# EAGLE schematic hw_DAA (EAGLE 7.6.0), part 3 of 4
## Sheet 22 of 34: DRR4 Memories 3-4
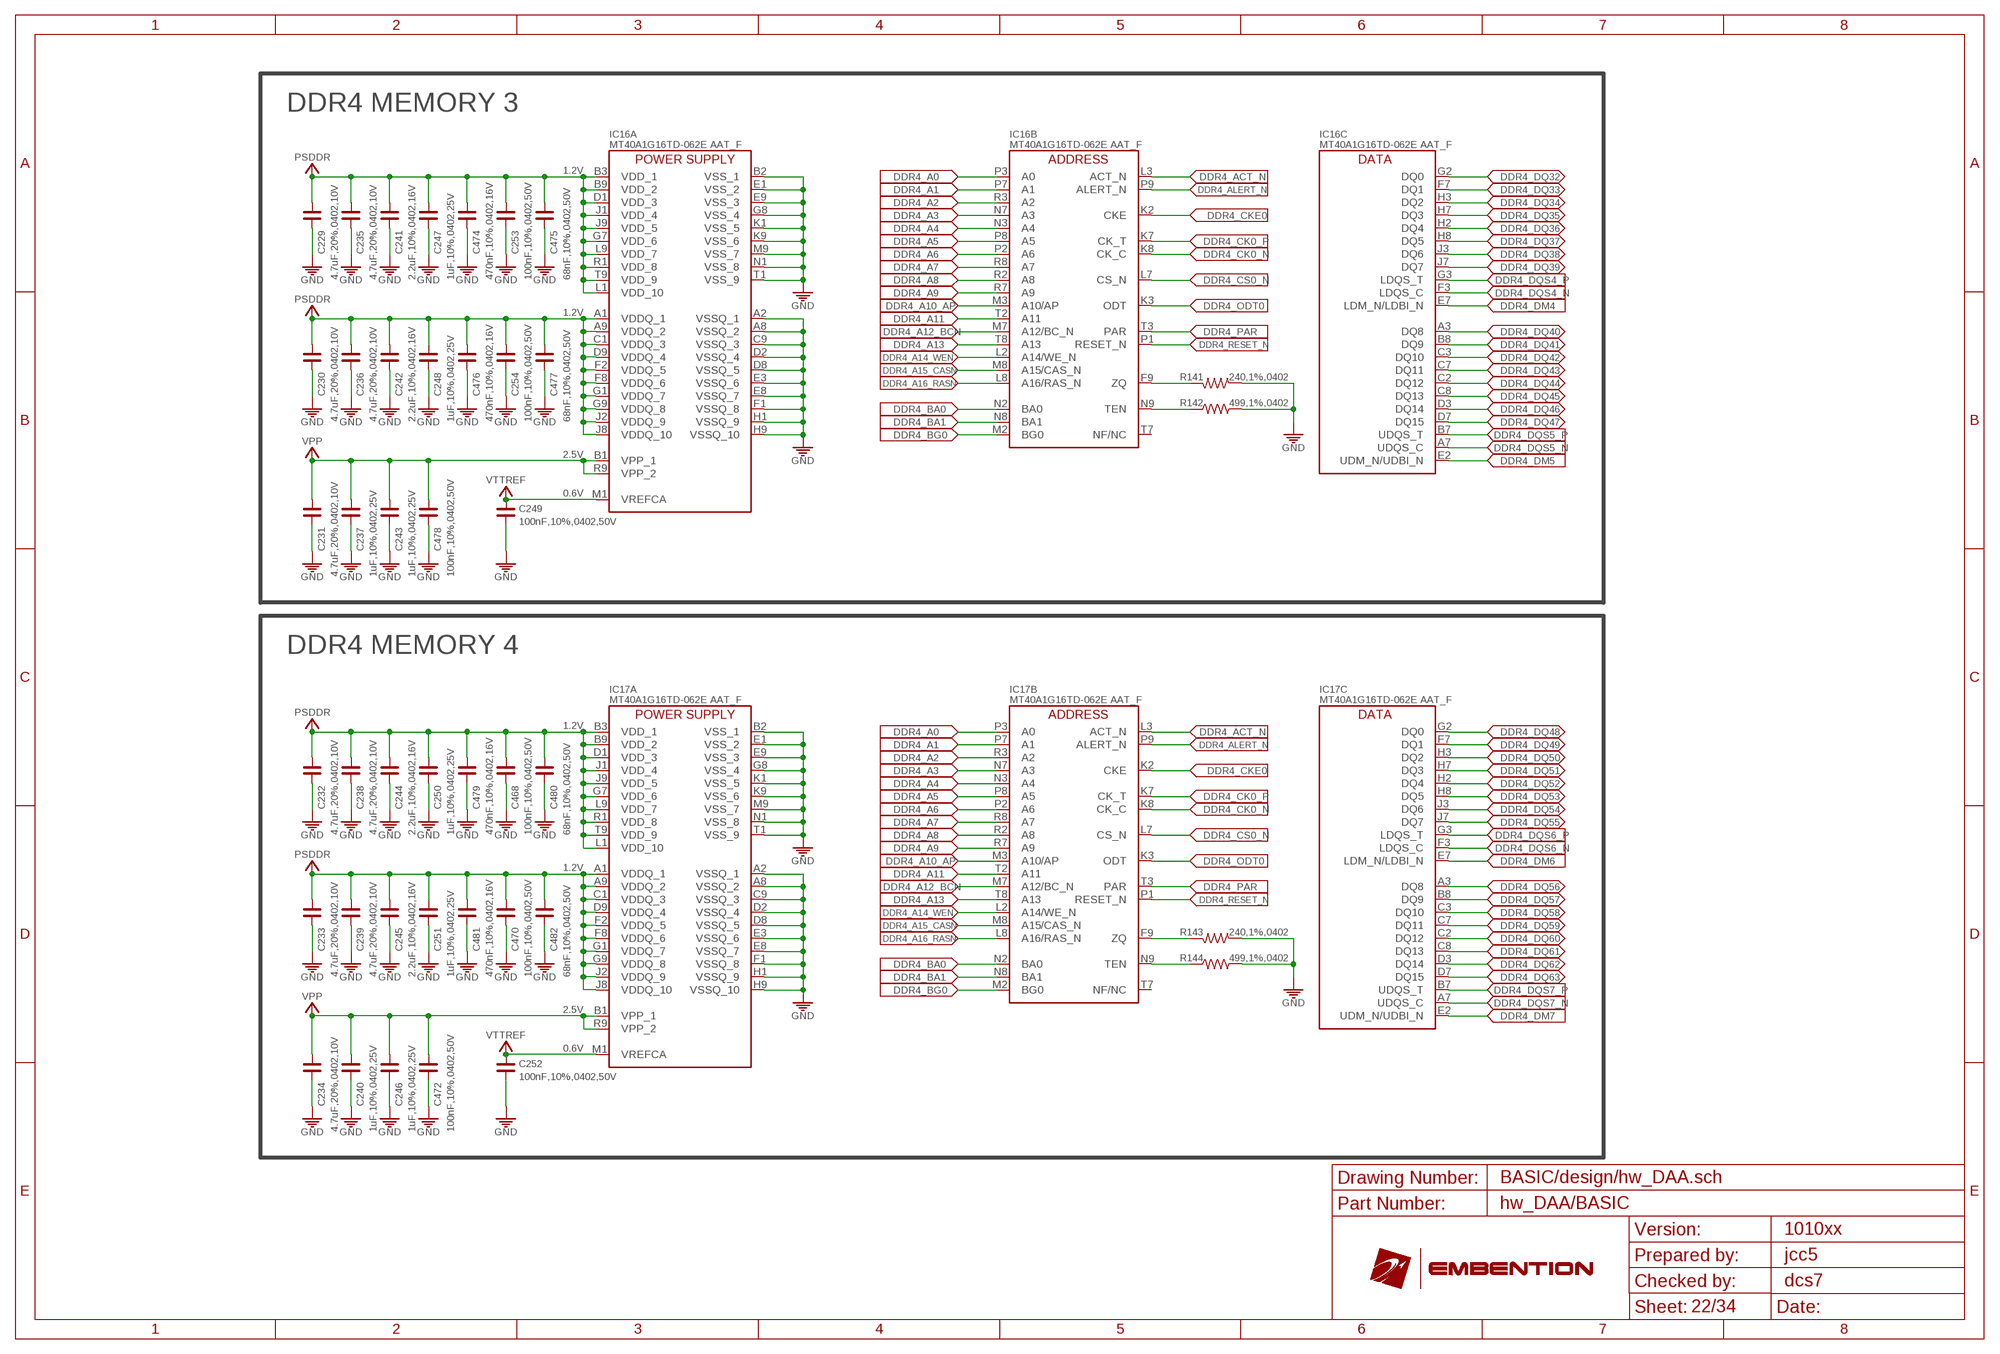
[diagram p21: schematic, sheet 22]

### Parts
C229  4.7uF,20%,0402,10V  C_0402  [C0402]
C230  4.7uF,20%,0402,10V  C_0402  [C0402]
C231  4.7uF,20%,0402,10V  C_0402  [C0402]
C232  4.7uF,20%,0402,10V  C_0402  [C0402]
C233  4.7uF,20%,0402,10V  C_0402  [C0402]
C234  4.7uF,20%,0402,10V  C_0402  [C0402]
C235  4.7uF,20%,0402,10V  C_0402  [C0402]
C236  4.7uF,20%,0402,10V  C_0402  [C0402]
C237  1uF,10%,0402,25V  C_0402  [C0402]
C238  4.7uF,20%,0402,10V  C_0402  [C0402]
C239  4.7uF,20%,0402,10V  C_0402  [C0402]
C240  1uF,10%,0402,25V  C_0402  [C0402]
C241  2.2uF,10%,0402,16V  C_0402  [C0402]
C242  2.2uF,10%,0402,16V  C_0402  [C0402]
C243  1uF,10%,0402,25V  C_0402  [C0402]
C244  2.2uF,10%,0402,16V  C_0402  [C0402]
C245  2.2uF,10%,0402,16V  C_0402  [C0402]
C246  1uF,10%,0402,25V  C_0402  [C0402]
C247  1uF,10%,0402,25V  C_0402  [C0402]
C248  1uF,10%,0402,25V  C_0402  [C0402]
C249  100nF,10%,0402,50V  C_0402  [C0402]
C250  1uF,10%,0402,25V  C_0402  [C0402]
C251  1uF,10%,0402,25V  C_0402  [C0402]
C252  100nF,10%,0402,50V  C_0402  [C0402]
C253  100nF,10%,0402,50V  C_0402  [C0402]
C254  100nF,10%,0402,50V  C_0402  [C0402]
C468  100nF,10%,0402,50V  C_0402  [C0402]
C470  100nF,10%,0402,50V  C_0402  [C0402]
C472  100nF,10%,0402,50V  C_0402  [C0402]
C474  470nF,10%,0402,16V  C_0402  [C0402]
C475  68nF,10%,0402,50V  C_0402  [C0402]
C476  470nF,10%,0402,16V  C_0402  [C0402]
C477  68nF,10%,0402,50V  C_0402  [C0402]
C478  100nF,10%,0402,50V  C_0402  [C0402]
C479  470nF,10%,0402,16V  C_0402  [C0402]
C480  68nF,10%,0402,50V  C_0402  [C0402]
C481  470nF,10%,0402,16V  C_0402  [C0402]
C482  68nF,10%,0402,50V  C_0402  [C0402]
IC16  MT40A1G16TD-062E AAT_F  MT40A1G16TD-062ENSMD  [FBGA96_NSMD_MICRON]
IC17  MT40A1G16TD-062E AAT_F  MT40A1G16TD-062ENSMD  [FBGA96_NSMD_MICRON]
R141  240,1%,0402  R_0402  [R0402]
R142  499,1%,0402  R_0402  [R0402]
R143  240,1%,0402  R_0402  [R0402]
R144  499,1%,0402  R_0402  [R0402]

### Nets
DDR4_A0 [DDR4_50]: IC16.P3(B:A0) IC17.P3(B:A0) ; also sheet 20,21,23
DDR4_A1 [DDR4_50]: IC16.P7(B:A1) IC17.P7(B:A1) ; also sheet 20,21,23
DDR4_A2 [DDR4_50]: IC16.R3(B:A2) IC17.R3(B:A2) ; also sheet 20,21,23
DDR4_A3 [DDR4_50]: IC16.N7(B:A3) IC17.N7(B:A3) ; also sheet 20,21,23
DDR4_A4 [DDR4_50]: IC16.N3(B:A4) IC17.N3(B:A4) ; also sheet 20,21,23
DDR4_A5 [DDR4_50]: IC16.P8(B:A5) IC17.P8(B:A5) ; also sheet 20,21,23
DDR4_A6 [DDR4_50]: IC16.P2(B:A6) IC17.P2(B:A6) ; also sheet 20,21,23
DDR4_A7 [DDR4_50]: IC16.R8(B:A7) IC17.R8(B:A7) ; also sheet 20,21,23
DDR4_A8 [DDR4_50]: IC16.R2(B:A8) IC17.R2(B:A8) ; also sheet 20,21,23
DDR4_A9 [DDR4_50]: IC16.R7(B:A9) IC17.R7(B:A9) ; also sheet 20,21,23
DDR4_A10_AP [DDR4_50]: IC16.M3(B:A10/AP) IC17.M3(B:A10/AP) ; also sheet 20,21,23
DDR4_A11 [DDR4_50]: IC16.T2(B:A11) IC17.T2(B:A11) ; also sheet 20,21,23
DDR4_A12_BCN [DDR4_50]: IC16.M7(B:A12/BC_N) IC17.M7(B:A12/BC_N) ; also sheet 20,21,23
DDR4_A13 [DDR4_50]: IC16.T8(B:A13) IC17.T8(B:A13) ; also sheet 20,21,23
DDR4_A14_WEN [DDR4_50]: IC16.L2(B:A14/WE_N) IC17.L2(B:A14/WE_N) ; also sheet 20,21,23
DDR4_A15_CASN [DDR4_50]: IC16.M8(B:A15/CAS_N) IC17.M8(B:A15/CAS_N) ; also sheet 20,21,23
DDR4_A16_RASN [DDR4_50]: IC16.L8(B:A16/RAS_N) IC17.L8(B:A16/RAS_N) ; also sheet 20,21,23
DDR4_ACT_N [DDR4_50]: IC16.L3(B:ACT_N) IC17.L3(B:ACT_N) ; also sheet 20,21,23
DDR4_ALERT_N [DDR4_50]: IC16.P9(B:ALERT_N) IC17.P9(B:ALERT_N) ; also sheet 20,21,23
DDR4_BA0 [DDR4_50]: IC16.N2(B:BA0) IC17.N2(B:BA0) ; also sheet 20,21,23
DDR4_BA1 [DDR4_50]: IC16.N8(B:BA1) IC17.N8(B:BA1) ; also sheet 20,21,23
DDR4_BG0 [DDR4_50]: IC16.M2(B:BG0) IC17.M2(B:BG0) ; also sheet 20,21,23
DDR4_CK0_N [DDR4_90]: IC16.K8(B:CK_C) IC17.K8(B:CK_C) ; also sheet 20,21,23
DDR4_CK0_P [DDR4_90]: IC16.K7(B:CK_T) IC17.K7(B:CK_T) ; also sheet 20,21,23
DDR4_CKE0 [DDR4_50]: IC16.K2(B:CKE) IC17.K2(B:CKE) ; also sheet 20,21,23
DDR4_CS0_N [DDR4_50]: IC16.L7(B:CS_N) IC17.L7(B:CS_N) ; also sheet 20,21,23
DDR4_DM4 [DDR4_50]: IC16.E7(C:LDM_N/LDBI_N) ; also sheet 20
DDR4_DM5 [DDR4_50]: IC16.E2(C:UDM_N/UDBI_N) ; also sheet 20
DDR4_DM6 [DDR4_50]: IC17.E7(C:LDM_N/LDBI_N) ; also sheet 20
DDR4_DM7 [DDR4_50]: IC17.E2(C:UDM_N/UDBI_N) ; also sheet 20
DDR4_DQ32 [DDR4_50]: IC16.G2(C:DQ0) ; also sheet 20
DDR4_DQ33 [DDR4_50]: IC16.F7(C:DQ1) ; also sheet 20
DDR4_DQ34 [DDR4_50]: IC16.H3(C:DQ2) ; also sheet 20
DDR4_DQ35 [DDR4_50]: IC16.H7(C:DQ3) ; also sheet 20
DDR4_DQ36 [DDR4_50]: IC16.H2(C:DQ4) ; also sheet 20
DDR4_DQ37 [DDR4_50]: IC16.H8(C:DQ5) ; also sheet 20
DDR4_DQ38 [DDR4_50]: IC16.J3(C:DQ6) ; also sheet 20
DDR4_DQ39 [DDR4_50]: IC16.J7(C:DQ7) ; also sheet 20
DDR4_DQ40 [DDR4_50]: IC16.A3(C:DQ8) ; also sheet 20
DDR4_DQ41 [DDR4_50]: IC16.B8(C:DQ9) ; also sheet 20
DDR4_DQ42 [DDR4_50]: IC16.C3(C:DQ10) ; also sheet 20
DDR4_DQ43 [DDR4_50]: IC16.C7(C:DQ11) ; also sheet 20
DDR4_DQ44 [DDR4_50]: IC16.C2(C:DQ12) ; also sheet 20
DDR4_DQ45 [DDR4_50]: IC16.C8(C:DQ13) ; also sheet 20
DDR4_DQ46 [DDR4_50]: IC16.D3(C:DQ14) ; also sheet 20
DDR4_DQ47 [DDR4_50]: IC16.D7(C:DQ15) ; also sheet 20
DDR4_DQ48 [DDR4_50]: IC17.G2(C:DQ0) ; also sheet 20
DDR4_DQ49 [DDR4_50]: IC17.F7(C:DQ1) ; also sheet 20
DDR4_DQ50 [DDR4_50]: IC17.H3(C:DQ2) ; also sheet 20
DDR4_DQ51 [DDR4_50]: IC17.H7(C:DQ3) ; also sheet 20
DDR4_DQ52 [DDR4_50]: IC17.H2(C:DQ4) ; also sheet 20
DDR4_DQ53 [DDR4_50]: IC17.H8(C:DQ5) ; also sheet 20
DDR4_DQ54 [DDR4_50]: IC17.J3(C:DQ6) ; also sheet 20
DDR4_DQ55 [DDR4_50]: IC17.J7(C:DQ7) ; also sheet 20
DDR4_DQ56 [DDR4_50]: IC17.A3(C:DQ8) ; also sheet 20
DDR4_DQ57 [DDR4_50]: IC17.B8(C:DQ9) ; also sheet 20
DDR4_DQ58 [DDR4_50]: IC17.C3(C:DQ10) ; also sheet 20
DDR4_DQ59 [DDR4_50]: IC17.C7(C:DQ11) ; also sheet 20
DDR4_DQ60 [DDR4_50]: IC17.C2(C:DQ12) ; also sheet 20
DDR4_DQ61 [DDR4_50]: IC17.C8(C:DQ13) ; also sheet 20
DDR4_DQ62 [DDR4_50]: IC17.D3(C:DQ14) ; also sheet 20
DDR4_DQ63 [DDR4_50]: IC17.D7(C:DQ15) ; also sheet 20
DDR4_DQS4_N [DDR4_90]: IC16.F3(C:LDQS_C) ; also sheet 20
DDR4_DQS4_P [DDR4_90]: IC16.G3(C:LDQS_T) ; also sheet 20
DDR4_DQS5_N [DDR4_90]: IC16.A7(C:UDQS_C) ; also sheet 20
DDR4_DQS5_P [DDR4_90]: IC16.B7(C:UDQS_T) ; also sheet 20
DDR4_DQS6_N [DDR4_90]: IC17.F3(C:LDQS_C) ; also sheet 20
DDR4_DQS6_P [DDR4_90]: IC17.G3(C:LDQS_T) ; also sheet 20
DDR4_DQS7_N [DDR4_90]: IC17.A7(C:UDQS_C) ; also sheet 20
DDR4_DQS7_P [DDR4_90]: IC17.B7(C:UDQS_T) ; also sheet 20
DDR4_ODT0 [DDR4_50]: IC16.K3(B:ODT) IC17.K3(B:ODT) ; also sheet 20,21,23
DDR4_PAR [DDR4_50]: IC16.T3(B:PAR) IC17.T3(B:PAR) ; also sheet 20,21,23
DDR4_RESET_N [DDR4_50]: IC16.P1(B:RESET_N) IC17.P1(B:RESET_N) ; also sheet 20,21,23
DDR4_TEN_2: IC16.N9(B:TEN) R142.1
DDR4_TEN_3: IC17.N9(B:TEN) R144.1
DDR4_ZQ_2: IC16.F9(B:ZQ) R141.2
DDR4_ZQ_3: IC17.F9(B:ZQ) R143.2
GND: C229.2 C230.2 C231.2 C232.2 C233.2 C234.2 C235.2 C236.2 C237.2 C238.2 C239.2 C240.2 C241.2 C242.2 C243.2 C244.2 C245.2 C246.2 C247.2 C248.2 C249.2 C250.2 C251.2 C252.2 C253.2 C254.2 C468.2 C470.2 C472.2 C474.2 C475.2 C476.2 C477.2 C478.2 C479.2 C480.2 C481.2 C482.2 IC16.A2(A:VSSQ_1) IC16.A8(A:VSSQ_2) IC16.B2(A:VSS_1) IC16.C9(A:VSSQ_3) IC16.D2(A:VSSQ_4) IC16.D8(A:VSSQ_5) IC16.E1(A:VSS_2) IC16.E3(A:VSSQ_6) IC16.E8(A:VSSQ_7) IC16.E9(A:VSS_3) IC16.F1(A:VSSQ_8) IC16.G8(A:VSS_4) IC16.H1(A:VSSQ_9) IC16.H9(A:VSSQ_10) IC16.K1(A:VSS_5) IC16.K9(A:VSS_6) IC16.M9(A:VSS_7) IC16.N1(A:VSS_8) IC16.T1(A:VSS_9) IC17.A2(A:VSSQ_1) IC17.A8(A:VSSQ_2) IC17.B2(A:VSS_1) IC17.C9(A:VSSQ_3) IC17.D2(A:VSSQ_4) IC17.D8(A:VSSQ_5) IC17.E1(A:VSS_2) IC17.E3(A:VSSQ_6) IC17.E8(A:VSSQ_7) IC17.E9(A:VSS_3) IC17.F1(A:VSSQ_8) IC17.G8(A:VSS_4) IC17.H1(A:VSSQ_9) IC17.H9(A:VSSQ_10) IC17.K1(A:VSS_5) IC17.K9(A:VSS_6) IC17.M9(A:VSS_7) IC17.N1(A:VSS_8) IC17.T1(A:VSS_9) R141.1 R142.2 R143.1 R144.2 ; also sheet 2,3,4,5,6,7,8,9,10,11,12,13,14,15,17,18,20,21,23,24,25,26,27,28,29,30,31,32,33
PSDDR: C229.1 C230.1 C232.1 C233.1 C235.1 C236.1 C238.1 C239.1 C241.1 C242.1 C244.1 C245.1 C247.1 C248.1 C250.1 C251.1 C253.1 C254.1 C468.1 C470.1 C474.1 C475.1 C476.1 C477.1 C479.1 C480.1 C481.1 C482.1 IC16.A1(A:VDDQ_1) IC16.A9(A:VDDQ_2) IC16.B3(A:VDD_1) IC16.B9(A:VDD_2) IC16.C1(A:VDDQ_3) IC16.D1(A:VDD_3) IC16.D9(A:VDDQ_4) IC16.F2(A:VDDQ_5) IC16.F8(A:VDDQ_6) IC16.G1(A:VDDQ_7) IC16.G7(A:VDD_6) IC16.G9(A:VDDQ_8) IC16.J1(A:VDD_4) IC16.J2(A:VDDQ_9) IC16.J8(A:VDDQ_10) IC16.J9(A:VDD_5) IC16.L1(A:VDD_10) IC16.L9(A:VDD_7) IC16.R1(A:VDD_8) IC16.T9(A:VDD_9) IC17.A1(A:VDDQ_1) IC17.A9(A:VDDQ_2) IC17.B3(A:VDD_1) IC17.B9(A:VDD_2) IC17.C1(A:VDDQ_3) IC17.D1(A:VDD_3) IC17.D9(A:VDDQ_4) IC17.F2(A:VDDQ_5) IC17.F8(A:VDDQ_6) IC17.G1(A:VDDQ_7) IC17.G7(A:VDD_6) IC17.G9(A:VDDQ_8) IC17.J1(A:VDD_4) IC17.J2(A:VDDQ_9) IC17.J8(A:VDDQ_10) IC17.J9(A:VDD_5) IC17.L1(A:VDD_10) IC17.L9(A:VDD_7) IC17.R1(A:VDD_8) IC17.T9(A:VDD_9) ; also sheet 8,12,21,23
VPP: C231.1 C234.1 C237.1 C240.1 C243.1 C246.1 C472.1 C478.1 IC16.B1(A:VPP_1) IC16.R9(A:VPP_2) IC17.B1(A:VPP_1) IC17.R9(A:VPP_2) ; also sheet 8,21,23
VTTREF: C249.1 C252.1 IC16.M1(A:VREFCA) IC17.M1(A:VREFCA) ; also sheet 8,21,23
Unconnected: IC16.T7(B:NF/NC) IC17.T7(B:NF/NC)

### Notes on the sheet
- DDR4 MEMORY 3
- 1.2V
- 1.2V
- 2.5V
- 0.6V
- DDR4 MEMORY 4
- 1.2V
- 1.2V
- 2.5V
- 0.6V
- BASIC/design/hw_DAA.sch
- hw_DAA/BASIC
- 1010xx
- jcc5
- dcs7

## Sheet 23 of 34: DDR4 Memory ECC Bank
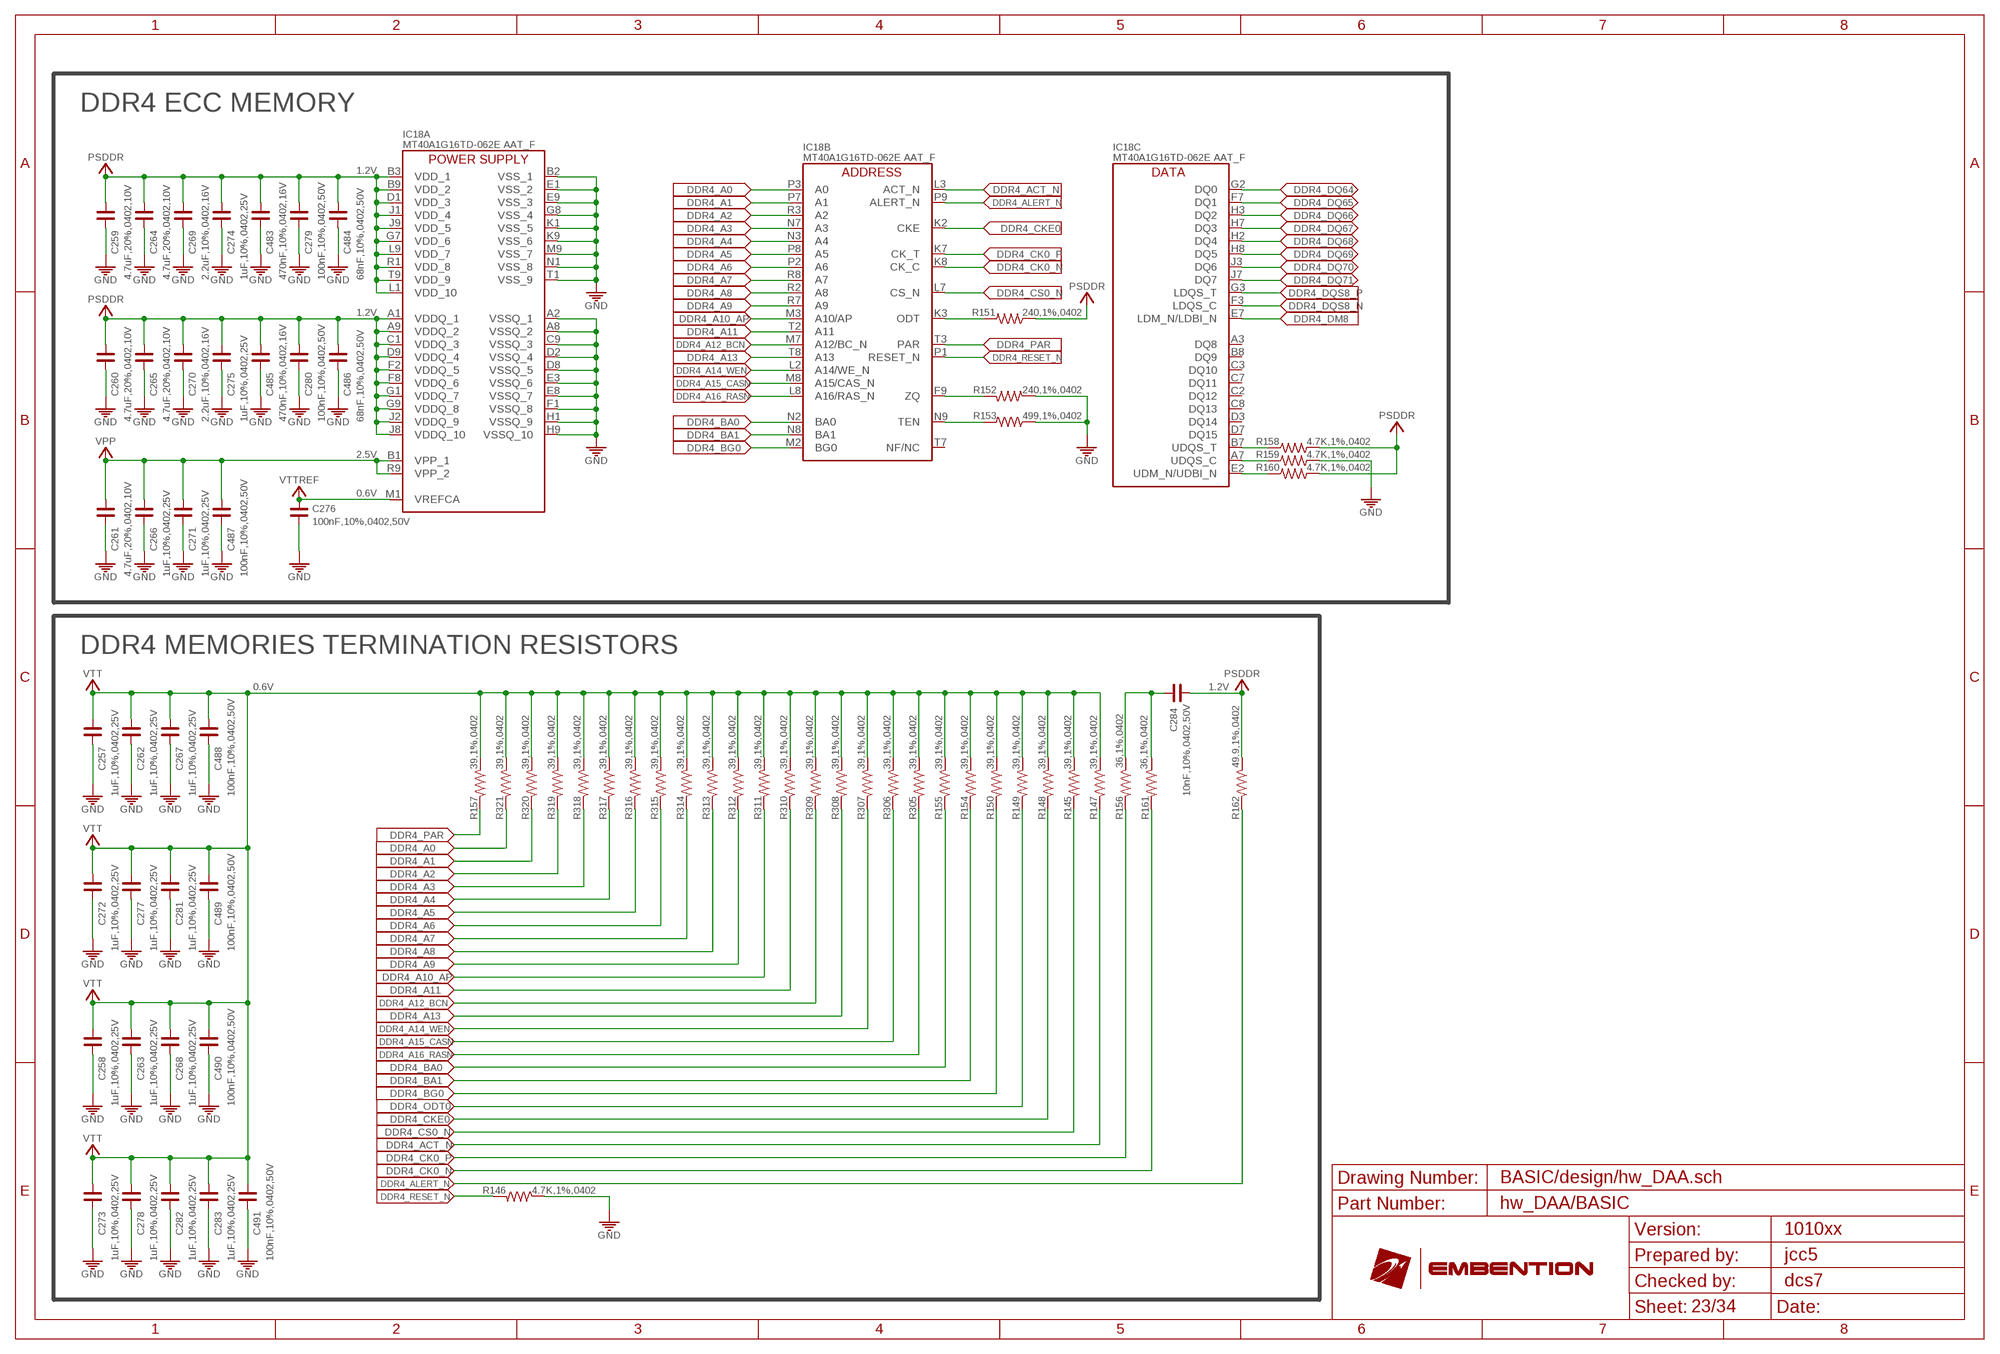
[diagram p22: schematic, sheet 23]

### Parts
C257  1uF,10%,0402,25V  C_0402  [C0402]
C258  1uF,10%,0402,25V  C_0402  [C0402]
C259  4.7uF,20%,0402,10V  C_0402  [C0402]
C260  4.7uF,20%,0402,10V  C_0402  [C0402]
C261  4.7uF,20%,0402,10V  C_0402  [C0402]
C262  1uF,10%,0402,25V  C_0402  [C0402]
C263  1uF,10%,0402,25V  C_0402  [C0402]
C264  4.7uF,20%,0402,10V  C_0402  [C0402]
C265  4.7uF,20%,0402,10V  C_0402  [C0402]
C266  1uF,10%,0402,25V  C_0402  [C0402]
C267  1uF,10%,0402,25V  C_0402  [C0402]
C268  1uF,10%,0402,25V  C_0402  [C0402]
C269  2.2uF,10%,0402,16V  C_0402  [C0402]
C270  2.2uF,10%,0402,16V  C_0402  [C0402]
C271  1uF,10%,0402,25V  C_0402  [C0402]
C272  1uF,10%,0402,25V  C_0402  [C0402]
C273  1uF,10%,0402,25V  C_0402  [C0402]
C274  1uF,10%,0402,25V  C_0402  [C0402]
C275  1uF,10%,0402,25V  C_0402  [C0402]
C276  100nF,10%,0402,50V  C_0402  [C0402]
C277  1uF,10%,0402,25V  C_0402  [C0402]
C278  1uF,10%,0402,25V  C_0402  [C0402]
C279  100nF,10%,0402,50V  C_0402  [C0402]
C280  100nF,10%,0402,50V  C_0402  [C0402]
C281  1uF,10%,0402,25V  C_0402  [C0402]
C282  1uF,10%,0402,25V  C_0402  [C0402]
C283  1uF,10%,0402,25V  C_0402  [C0402]
C284  10nF,10%,0402,50V  C_0402  [C0402]
C483  470nF,10%,0402,16V  C_0402  [C0402]
C484  68nF,10%,0402,50V  C_0402  [C0402]
C485  470nF,10%,0402,16V  C_0402  [C0402]
C486  68nF,10%,0402,50V  C_0402  [C0402]
C487  100nF,10%,0402,50V  C_0402  [C0402]
C488  100nF,10%,0402,50V  C_0402  [C0402]
C489  100nF,10%,0402,50V  C_0402  [C0402]
C490  100nF,10%,0402,50V  C_0402  [C0402]
C491  100nF,10%,0402,50V  C_0402  [C0402]
IC18  MT40A1G16TD-062E AAT_F  MT40A1G16TD-062ENSMD  [FBGA96_NSMD_MICRON]
R145  39,1%,0402  R_0402  [R0402]
R146  4.7K,1%,0402  R_0402  [R0402]
R147  39,1%,0402  R_0402  [R0402]
R148  39,1%,0402  R_0402  [R0402]
R149  39,1%,0402  R_0402  [R0402]
R150  39,1%,0402  R_0402  [R0402]
R151  240,1%,0402  R_0402  [R0402]
R152  240,1%,0402  R_0402  [R0402]
R153  499,1%,0402  R_0402  [R0402]
R154  39,1%,0402  R_0402  [R0402]
R155  39,1%,0402  R_0402  [R0402]
R156  36,1%,0402  R_0402  [R0402]
R157  39,1%,0402  R_0402  [R0402]
R158  4.7K,1%,0402  R_0402  [R0402]
R159  4.7K,1%,0402  R_0402  [R0402]
R160  4.7K,1%,0402  R_0402  [R0402]
R161  36,1%,0402  R_0402  [R0402]
R162  49.9,1%,0402  R_0402  [R0402]
R305  39,1%,0402  R_0402  [R0402]
R306  39,1%,0402  R_0402  [R0402]
R307  39,1%,0402  R_0402  [R0402]
R308  39,1%,0402  R_0402  [R0402]
R309  39,1%,0402  R_0402  [R0402]
R310  39,1%,0402  R_0402  [R0402]
R311  39,1%,0402  R_0402  [R0402]
R312  39,1%,0402  R_0402  [R0402]
R313  39,1%,0402  R_0402  [R0402]
R314  39,1%,0402  R_0402  [R0402]
R315  39,1%,0402  R_0402  [R0402]
R316  39,1%,0402  R_0402  [R0402]
R317  39,1%,0402  R_0402  [R0402]
R318  39,1%,0402  R_0402  [R0402]
R319  39,1%,0402  R_0402  [R0402]
R320  39,1%,0402  R_0402  [R0402]
R321  39,1%,0402  R_0402  [R0402]

### Nets
DDR4_A0 [DDR4_50]: IC18.P3(B:A0) R321.2 ; also sheet 20,21,22
DDR4_A1 [DDR4_50]: IC18.P7(B:A1) R320.2 ; also sheet 20,21,22
DDR4_A2 [DDR4_50]: IC18.R3(B:A2) R319.2 ; also sheet 20,21,22
DDR4_A3 [DDR4_50]: IC18.N7(B:A3) R318.2 ; also sheet 20,21,22
DDR4_A4 [DDR4_50]: IC18.N3(B:A4) R317.2 ; also sheet 20,21,22
DDR4_A5 [DDR4_50]: IC18.P8(B:A5) R316.2 ; also sheet 20,21,22
DDR4_A6 [DDR4_50]: IC18.P2(B:A6) R315.2 ; also sheet 20,21,22
DDR4_A7 [DDR4_50]: IC18.R8(B:A7) R314.2 ; also sheet 20,21,22
DDR4_A8 [DDR4_50]: IC18.R2(B:A8) R313.2 ; also sheet 20,21,22
DDR4_A9 [DDR4_50]: IC18.R7(B:A9) R312.2 ; also sheet 20,21,22
DDR4_A10_AP [DDR4_50]: IC18.M3(B:A10/AP) R311.2 ; also sheet 20,21,22
DDR4_A11 [DDR4_50]: IC18.T2(B:A11) R310.2 ; also sheet 20,21,22
DDR4_A12_BCN [DDR4_50]: IC18.M7(B:A12/BC_N) R309.2 ; also sheet 20,21,22
DDR4_A13 [DDR4_50]: IC18.T8(B:A13) R308.2 ; also sheet 20,21,22
DDR4_A14_WEN [DDR4_50]: IC18.L2(B:A14/WE_N) R307.2 ; also sheet 20,21,22
DDR4_A15_CASN [DDR4_50]: IC18.M8(B:A15/CAS_N) R306.2 ; also sheet 20,21,22
DDR4_A16_RASN [DDR4_50]: IC18.L8(B:A16/RAS_N) R305.2 ; also sheet 20,21,22
DDR4_ACT_N [DDR4_50]: IC18.L3(B:ACT_N) R147.2 ; also sheet 20,21,22
DDR4_ALERT_N [DDR4_50]: IC18.P9(B:ALERT_N) R162.2 ; also sheet 20,21,22
DDR4_BA0 [DDR4_50]: IC18.N2(B:BA0) R155.2 ; also sheet 20,21,22
DDR4_BA1 [DDR4_50]: IC18.N8(B:BA1) R154.2 ; also sheet 20,21,22
DDR4_BG0 [DDR4_50]: IC18.M2(B:BG0) R150.2 ; also sheet 20,21,22
DDR4_CK0_N [DDR4_90]: IC18.K8(B:CK_C) R161.2 ; also sheet 20,21,22
DDR4_CK0_P [DDR4_90]: IC18.K7(B:CK_T) R156.2 ; also sheet 20,21,22
DDR4_CKE0 [DDR4_50]: IC18.K2(B:CKE) R148.2 ; also sheet 20,21,22
DDR4_CS0_N [DDR4_50]: IC18.L7(B:CS_N) R145.2 ; also sheet 20,21,22
DDR4_DM8 [DDR4_50]: IC18.E7(C:LDM_N/LDBI_N) ; also sheet 20
DDR4_DQ64 [DDR4_50]: IC18.G2(C:DQ0) ; also sheet 20
DDR4_DQ65 [DDR4_50]: IC18.F7(C:DQ1) ; also sheet 20
DDR4_DQ66 [DDR4_50]: IC18.H3(C:DQ2) ; also sheet 20
DDR4_DQ67 [DDR4_50]: IC18.H7(C:DQ3) ; also sheet 20
DDR4_DQ68 [DDR4_50]: IC18.H2(C:DQ4) ; also sheet 20
DDR4_DQ69 [DDR4_50]: IC18.H8(C:DQ5) ; also sheet 20
DDR4_DQ70 [DDR4_50]: IC18.J3(C:DQ6) ; also sheet 20
DDR4_DQ71 [DDR4_50]: IC18.J7(C:DQ7) ; also sheet 20
DDR4_DQS8_N [DDR4_90]: IC18.F3(C:LDQS_C) ; also sheet 20
DDR4_DQS8_P [DDR4_90]: IC18.G3(C:LDQS_T) ; also sheet 20
DDR4_ODT0 [DDR4_50]: R149.2 ; also sheet 20,21,22
DDR4_ODT_LDQS: IC18.K3(B:ODT) R151.2
DDR4_PAR [DDR4_50]: IC18.T3(B:PAR) R157.2 ; also sheet 20,21,22
DDR4_RESET_N [DDR4_50]: IC18.P1(B:RESET_N) R146.1 ; also sheet 20,21,22
DDR4_TEN_4: IC18.N9(B:TEN) R153.1
DDR4_TER_CK: C284.1 R156.1 R161.1
DDR4_UDBI_N: IC18.E2(C:UDM_N/UDBI_N) R160.2
DDR4_UDQS_C: IC18.A7(C:UDQS_C) R159.2
DDR4_UDQS_T: IC18.B7(C:UDQS_T) R158.2
DDR4_ZQ_4: IC18.F9(B:ZQ) R152.2
GND: C257.2 C258.2 C259.2 C260.2 C261.2 C262.2 C263.2 C264.2 C265.2 C266.2 C267.2 C268.2 C269.2 C270.2 C271.2 C272.2 C273.2 C274.2 C275.2 C276.2 C277.2 C278.2 C279.2 C280.2 C281.2 C282.2 C283.2 C483.2 C484.2 C485.2 C486.2 C487.2 C488.2 C489.2 C490.2 C491.2 IC18.A2(A:VSSQ_1) IC18.A8(A:VSSQ_2) IC18.B2(A:VSS_1) IC18.C9(A:VSSQ_3) IC18.D2(A:VSSQ_4) IC18.D8(A:VSSQ_5) IC18.E1(A:VSS_2) IC18.E3(A:VSSQ_6) IC18.E8(A:VSSQ_7) IC18.E9(A:VSS_3) IC18.F1(A:VSSQ_8) IC18.G8(A:VSS_4) IC18.H1(A:VSSQ_9) IC18.H9(A:VSSQ_10) IC18.K1(A:VSS_5) IC18.K9(A:VSS_6) IC18.M9(A:VSS_7) IC18.N1(A:VSS_8) IC18.T1(A:VSS_9) R146.2 R152.1 R153.2 R159.1 ; also sheet 2,3,4,5,6,7,8,9,10,11,12,13,14,15,17,18,20,21,22,24,25,26,27,28,29,30,31,32,33
PSDDR: C259.1 C260.1 C264.1 C265.1 C269.1 C270.1 C274.1 C275.1 C279.1 C280.1 C284.2 C483.1 C484.1 C485.1 C486.1 IC18.A1(A:VDDQ_1) IC18.A9(A:VDDQ_2) IC18.B3(A:VDD_1) IC18.B9(A:VDD_2) IC18.C1(A:VDDQ_3) IC18.D1(A:VDD_3) IC18.D9(A:VDDQ_4) IC18.F2(A:VDDQ_5) IC18.F8(A:VDDQ_6) IC18.G1(A:VDDQ_7) IC18.G7(A:VDD_6) IC18.G9(A:VDDQ_8) IC18.J1(A:VDD_4) IC18.J2(A:VDDQ_9) IC18.J8(A:VDDQ_10) IC18.J9(A:VDD_5) IC18.L1(A:VDD_10) IC18.L9(A:VDD_7) IC18.R1(A:VDD_8) IC18.T9(A:VDD_9) R151.1 R158.1 R160.1 R162.1 ; also sheet 8,12,21,22
VPP: C261.1 C266.1 C271.1 C487.1 IC18.B1(A:VPP_1) IC18.R9(A:VPP_2) ; also sheet 8,21,22
VTT: C257.1 C258.1 C262.1 C263.1 C267.1 C268.1 C272.1 C273.1 C277.1 C278.1 C281.1 C282.1 C283.1 C488.1 C489.1 C490.1 C491.1 R145.1 R147.1 R148.1 R149.1 R150.1 R154.1 R155.1 R157.1 R305.1 R306.1 R307.1 R308.1 R309.1 R310.1 R311.1 R312.1 R313.1 R314.1 R315.1 R316.1 R317.1 R318.1 R319.1 R320.1 R321.1 ; also sheet 8
VTTREF: C276.1 IC18.M1(A:VREFCA) ; also sheet 8,21,22
Unconnected: IC18.A3(C:DQ8) IC18.B8(C:DQ9) IC18.C2(C:DQ12) IC18.C3(C:DQ10) IC18.C7(C:DQ11) IC18.C8(C:DQ13) IC18.D3(C:DQ14) IC18.D7(C:DQ15) IC18.T7(B:NF/NC)

### Notes on the sheet
- DDR4 ECC MEMORY
- 1.2V
- 1.2V
- 2.5V
- 0.6V
- DDR4 MEMORIES TERMINATION RESISTORS
- 0.6V | 1.2V
- BASIC/design/hw_DAA.sch
- hw_DAA/BASIC
- 1010xx
- jcc5
- dcs7

## Sheet 24 of 34: MicroSD Card
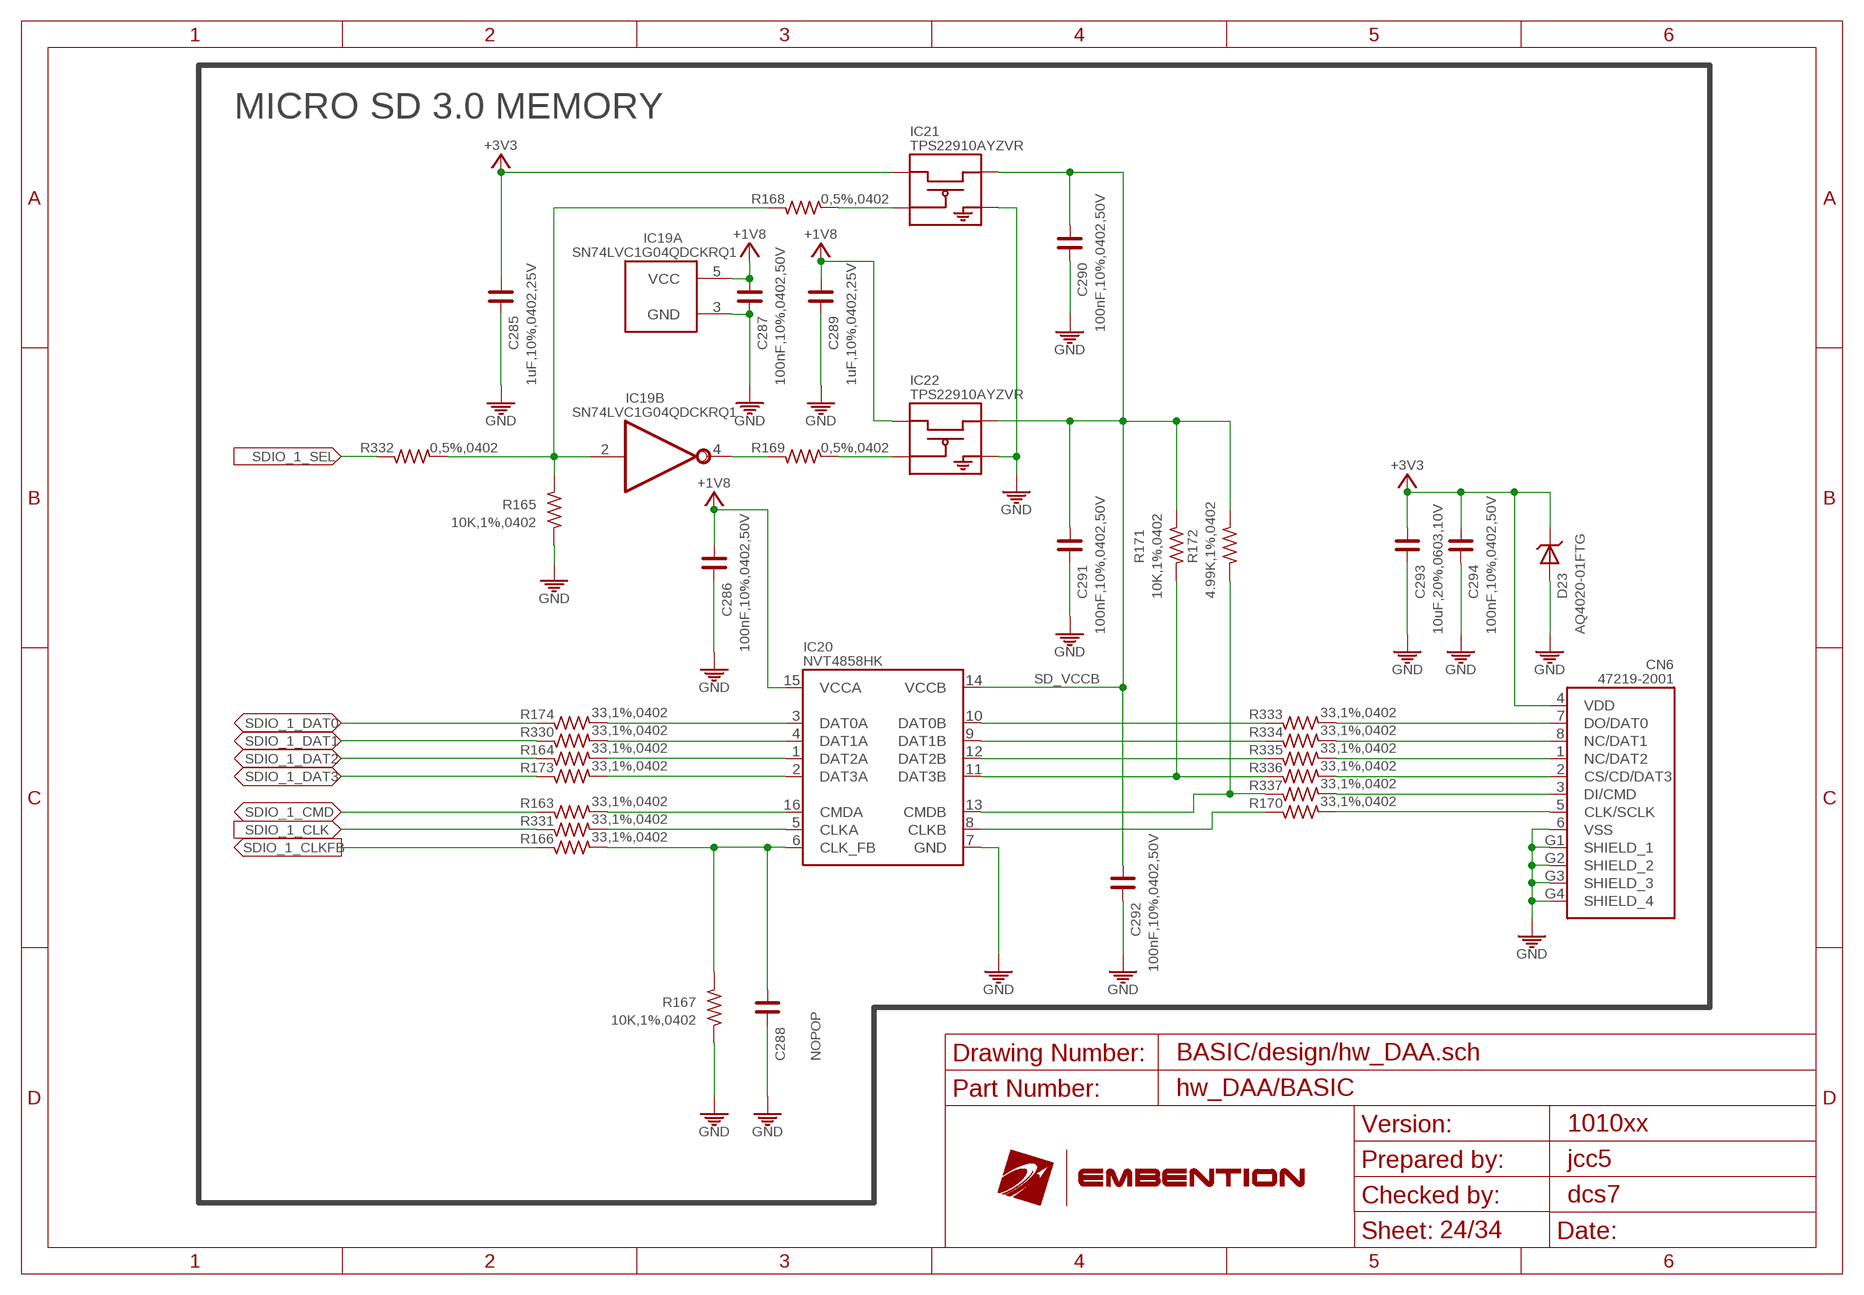
[diagram p23: schematic, sheet 24]

### Parts
C285  1uF,10%,0402,25V  C_0402  [C0402]
C286  100nF,10%,0402,50V  C_0402  [C0402]
C287  100nF,10%,0402,50V  C_0402  [C0402]
C288  NOPOP  C_0402  [C0402]
C289  1uF,10%,0402,25V  C_0402  [C0402]
C290  100nF,10%,0402,50V  C_0402  [C0402]
C291  100nF,10%,0402,50V  C_0402  [C0402]
C292  100nF,10%,0402,50V  C_0402  [C0402]
C293  10uF,20%,0603,10V  C_0603  [C0603]
C294  100nF,10%,0402,50V  C_0402  [C0402]
CN6  47219-2001  SD-LATCH  [SD-LATCH]
D23  AQ4020-01FTG  [SOD-323]
IC19  SN74LVC1G04QDCKRQ1  [DCK5]
IC20  NVT4858HK  [XQFN16]
IC21  TPS22910AYZVR  TPS2291XX  [DSBGA-4_YZV]
IC22  TPS22910AYZVR  TPS2291XX  [DSBGA-4_YZV]
R163  33,1%,0402  R_0402  [R0402]
R164  33,1%,0402  R_0402  [R0402]
R165  10K,1%,0402  R_0402  [R0402]
R166  33,1%,0402  R_0402  [R0402]
R167  10K,1%,0402  R_0402  [R0402]
R168  0,5%,0402  R_0402  [R0402]
R169  0,5%,0402  R_0402  [R0402]
R170  33,1%,0402  R_0402  [R0402]
R171  10K,1%,0402  R_0402  [R0402]
R172  4.99K,1%,0402  R_0402  [R0402]
R173  33,1%,0402  R_0402  [R0402]
R174  33,1%,0402  R_0402  [R0402]
R330  33,1%,0402  R_0402  [R0402]
R331  33,1%,0402  R_0402  [R0402]
R332  0,5%,0402  R_0402  [R0402]
R333  33,1%,0402  R_0402  [R0402]
R334  33,1%,0402  R_0402  [R0402]
R335  33,1%,0402  R_0402  [R0402]
R336  33,1%,0402  R_0402  [R0402]
R337  33,1%,0402  R_0402  [R0402]

### Nets
+1V8: C286.1 C287.1 C289.1 IC19.5(A:VCC) IC20.15(VCCA) IC22.A2(VIN) ; also sheet 5,27,33
+3V3: C285.1 C293.1 C294.1 CN6.4(VDD) D23.K IC21.A2(VIN) ; also sheet 5,10,25,26
GND: C285.2 C286.2 C287.2 C288.2 C289.2 C290.2 C291.2 C292.2 C293.2 C294.2 CN6.6(VSS) CN6.G1(SHIELD_1) CN6.G2(SHIELD_2) CN6.G3(SHIELD_3) CN6.G4(SHIELD_4) D23.A IC19.3(A:GND) IC20.7(GND) IC21.B1(GND) IC22.B1(GND) R165.1 R167.1 ; also sheet 2,3,4,5,6,7,8,9,10,11,12,13,14,15,17,18,20,21,22,23,25,26,27,28,29,30,31,32,33
N$37: IC19.4(B:O) R169.2
N$55: IC21.B2(ON) R168.1
N$56: IC22.B2(ON) R169.1
SD_CLK: CN6.5(CLK/SCLK) R170.1
SD_CMD: CN6.3(DI/CMD) R337.1
SD_D0: CN6.7(DO/DAT0) R333.1
SD_D1: CN6.8(NC/DAT1) R334.1
SD_D2: CN6.1(NC/DAT2) R335.1
SD_D3: CN6.2(CS/CD/DAT3) R336.1
SD_VCCB: C290.1 C291.1 C292.1 IC20.14(VCCB) IC21.A1(VOUT) IC22.A1(VOUT) R171.2 R172.2
SDIO_1_CLK: R331.2 ; also sheet 19
SDIO_1_CLKFB: R166.2 ; also sheet 16
SDIO_1_CMD: R163.2 ; also sheet 19
SDIO_1_DAT0: R174.2 ; also sheet 19
SDIO_1_DAT1: R330.2 ; also sheet 19
SDIO_1_DAT2: R164.2 ; also sheet 19
SDIO_1_DAT3: R173.2 ; also sheet 19
SDIO_1_SEL: R332.2 ; also sheet 19
SDIO_A_CLK: IC20.5(CLKA) R331.1
SDIO_A_CMD: IC20.16(CMDA) R163.1
SDIO_A_D0: IC20.3(DAT0A) R174.1
SDIO_A_D1: IC20.4(DAT1A) R330.1
SDIO_A_D2: IC20.1(DAT2A) R164.1
SDIO_A_D3: IC20.2(DAT3A) R173.1
SDIO_B_CLK: IC20.8(CLKB) R170.2
SDIO_B_CMD: IC20.13(CMDB) R172.1 R337.2
SDIO_B_D0: IC20.10(DAT0B) R333.2
SDIO_B_D1: IC20.9(DAT1B) R334.2
SDIO_B_D2: IC20.12(DAT2B) R335.2
SDIO_B_D3: IC20.11(DAT3B) R171.1 R336.2
SDIO_CLK_FB: C288.1 IC20.6(CLK_FB) R166.1 R167.2
SDIO_SEL: IC19.2(B:I) R165.2 R168.2 R332.1

### Notes on the sheet
- MICRO SD 3.0 MEMORY
- BASIC/design/hw_DAA.sch
- hw_DAA/BASIC
- 1010xx
- jcc5
- dcs7

## Sheet 25 of 34: CAN FD
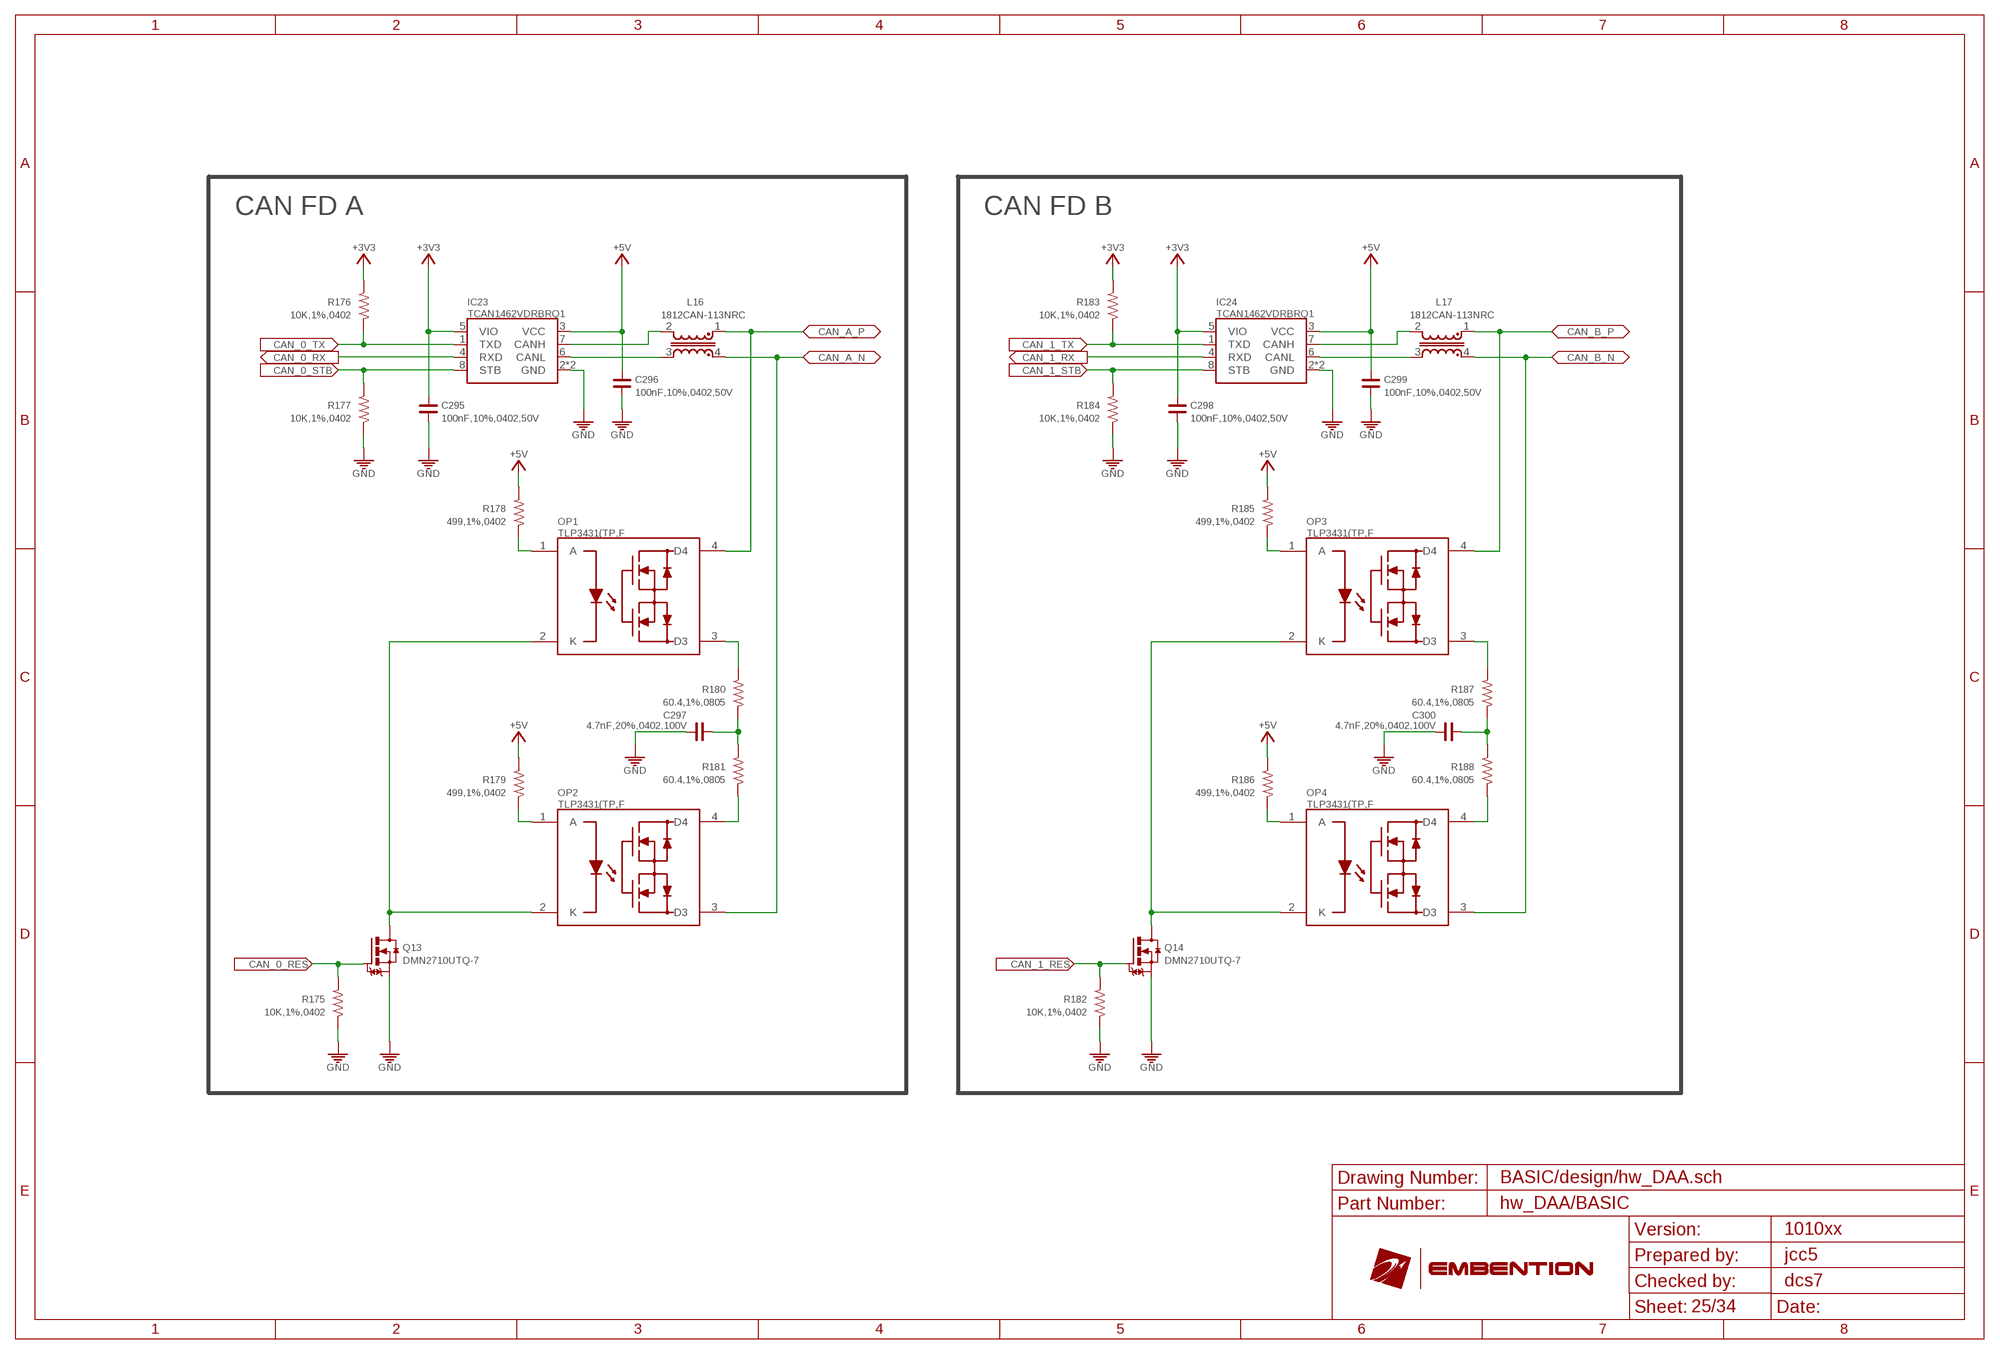
[diagram p24: schematic, sheet 25]

### Parts
C295  100nF,10%,0402,50V  C_0402  [C0402]
C296  100nF,10%,0402,50V  C_0402  [C0402]
C297  4.7nF,20%,0402,100V  C_0402  [C0402]
C298  100nF,10%,0402,50V  C_0402  [C0402]
C299  100nF,10%,0402,50V  C_0402  [C0402]
C300  4.7nF,20%,0402,100V  C_0402  [C0402]
IC23  TCAN1462VDRBRQ1  TCAN1462V-Q1VSON-8  [VSON-8]
IC24  TCAN1462VDRBRQ1  TCAN1462V-Q1VSON-8  [VSON-8]
L16  1812CAN-113NRC  1812CAN  [1812CAN]
L17  1812CAN-113NRC  1812CAN  [1812CAN]
OP1  TLP3431(TP,F  TLP3431  [VSON-4]
OP2  TLP3431(TP,F  TLP3431  [VSON-4]
OP3  TLP3431(TP,F  TLP3431  [VSON-4]
OP4  TLP3431(TP,F  TLP3431  [VSON-4]
Q13  DMN2710UTQ-7  [SOT-523]
Q14  DMN2710UTQ-7  [SOT-523]
R175  10K,1%,0402  R_0402  [R0402]
R176  10K,1%,0402  R_0402  [R0402]
R177  10K,1%,0402  R_0402  [R0402]
R178  499,1%,0402  R_0402  [R0402]
R179  499,1%,0402  R_0402  [R0402]
R180  60.4,1%,0805  R_0805  [R0805]
R181  60.4,1%,0805  R_0805  [R0805]
R182  10K,1%,0402  R_0402  [R0402]
R183  10K,1%,0402  R_0402  [R0402]
R184  10K,1%,0402  R_0402  [R0402]
R185  499,1%,0402  R_0402  [R0402]
R186  499,1%,0402  R_0402  [R0402]
R187  60.4,1%,0805  R_0805  [R0805]
R188  60.4,1%,0805  R_0805  [R0805]

### Nets
+3V3: C295.1 C298.1 IC23.5(VIO) IC24.5(VIO) R176.2 R183.2 ; also sheet 5,10,24,26
+5V: C296.1 C299.1 IC23.3(VCC) IC24.3(VCC) R178.2 R179.2 R185.2 R186.2 ; also sheet 3,4,5,7,8,26,33
CAN_0_RES: Q13.1(G) R175.2 ; also sheet 17
CAN_0_RX: IC23.4(RXD) ; also sheet 17
CAN_0_STB: IC23.8(STB) R177.2 ; also sheet 17
CAN_0_TX: IC23.1(TXD) R176.1 ; also sheet 17
CAN_1_RES: Q14.1(G) R182.2 ; also sheet 17
CAN_1_RX: IC24.4(RXD) ; also sheet 17
CAN_1_STB: IC24.8(STB) R184.2 ; also sheet 17
CAN_1_TX: IC24.1(TXD) R183.1 ; also sheet 17
CAN_A_N [DIFF120]: L16.4 OP2.3(D3) ; also sheet 2
CAN_A_P [DIFF120]: L16.1 OP1.4(D4) ; also sheet 2
CAN_B_N [DIFF120]: L17.4 OP4.3(D3) ; also sheet 2
CAN_B_P [DIFF120]: L17.1 OP3.4(D4) ; also sheet 2
CANA_N: IC23.6(CANL) L16.3
CANA_P: IC23.7(CANH) L16.2
CANB_N: IC24.6(CANL) L17.3
CANB_P: IC24.7(CANH) L17.2
GND: C295.2 C296.2 C297.1 C298.2 C299.2 C300.1 IC23.2(GND) IC23.9(GND) IC24.2(GND) IC24.9(GND) Q13.2(S) Q14.2(S) R175.1 R177.1 R182.1 R184.1 ; also sheet 2,3,4,5,6,7,8,9,10,11,12,13,14,15,17,18,20,21,22,23,24,26,27,28,29,30,31,32,33
N$3: OP2.4(D4) R181.1
N$4: OP1.2(K) OP2.2(K) Q13.3(D)
N$5: OP2.1(A) R179.1
N$8: C300.2 R187.1 R188.2
N$9: OP3.3(D3) R187.2
N$10: OP4.4(D4) R188.1
N$11: OP4.1(A) R186.1
N$12: C297.2 R180.1 R181.2
N$13: OP1.1(A) R178.1
N$14: OP3.1(A) R185.1
N$15: OP1.3(D3) R180.2
N$16: OP3.2(K) OP4.2(K) Q14.3(D)

### Notes on the sheet
- CAN FD A | CAN FD B
- BASIC/design/hw_DAA.sch
- hw_DAA/BASIC
- 1010xx
- jcc5
- dcs7

## Sheet 26 of 34: RS485 - RS232
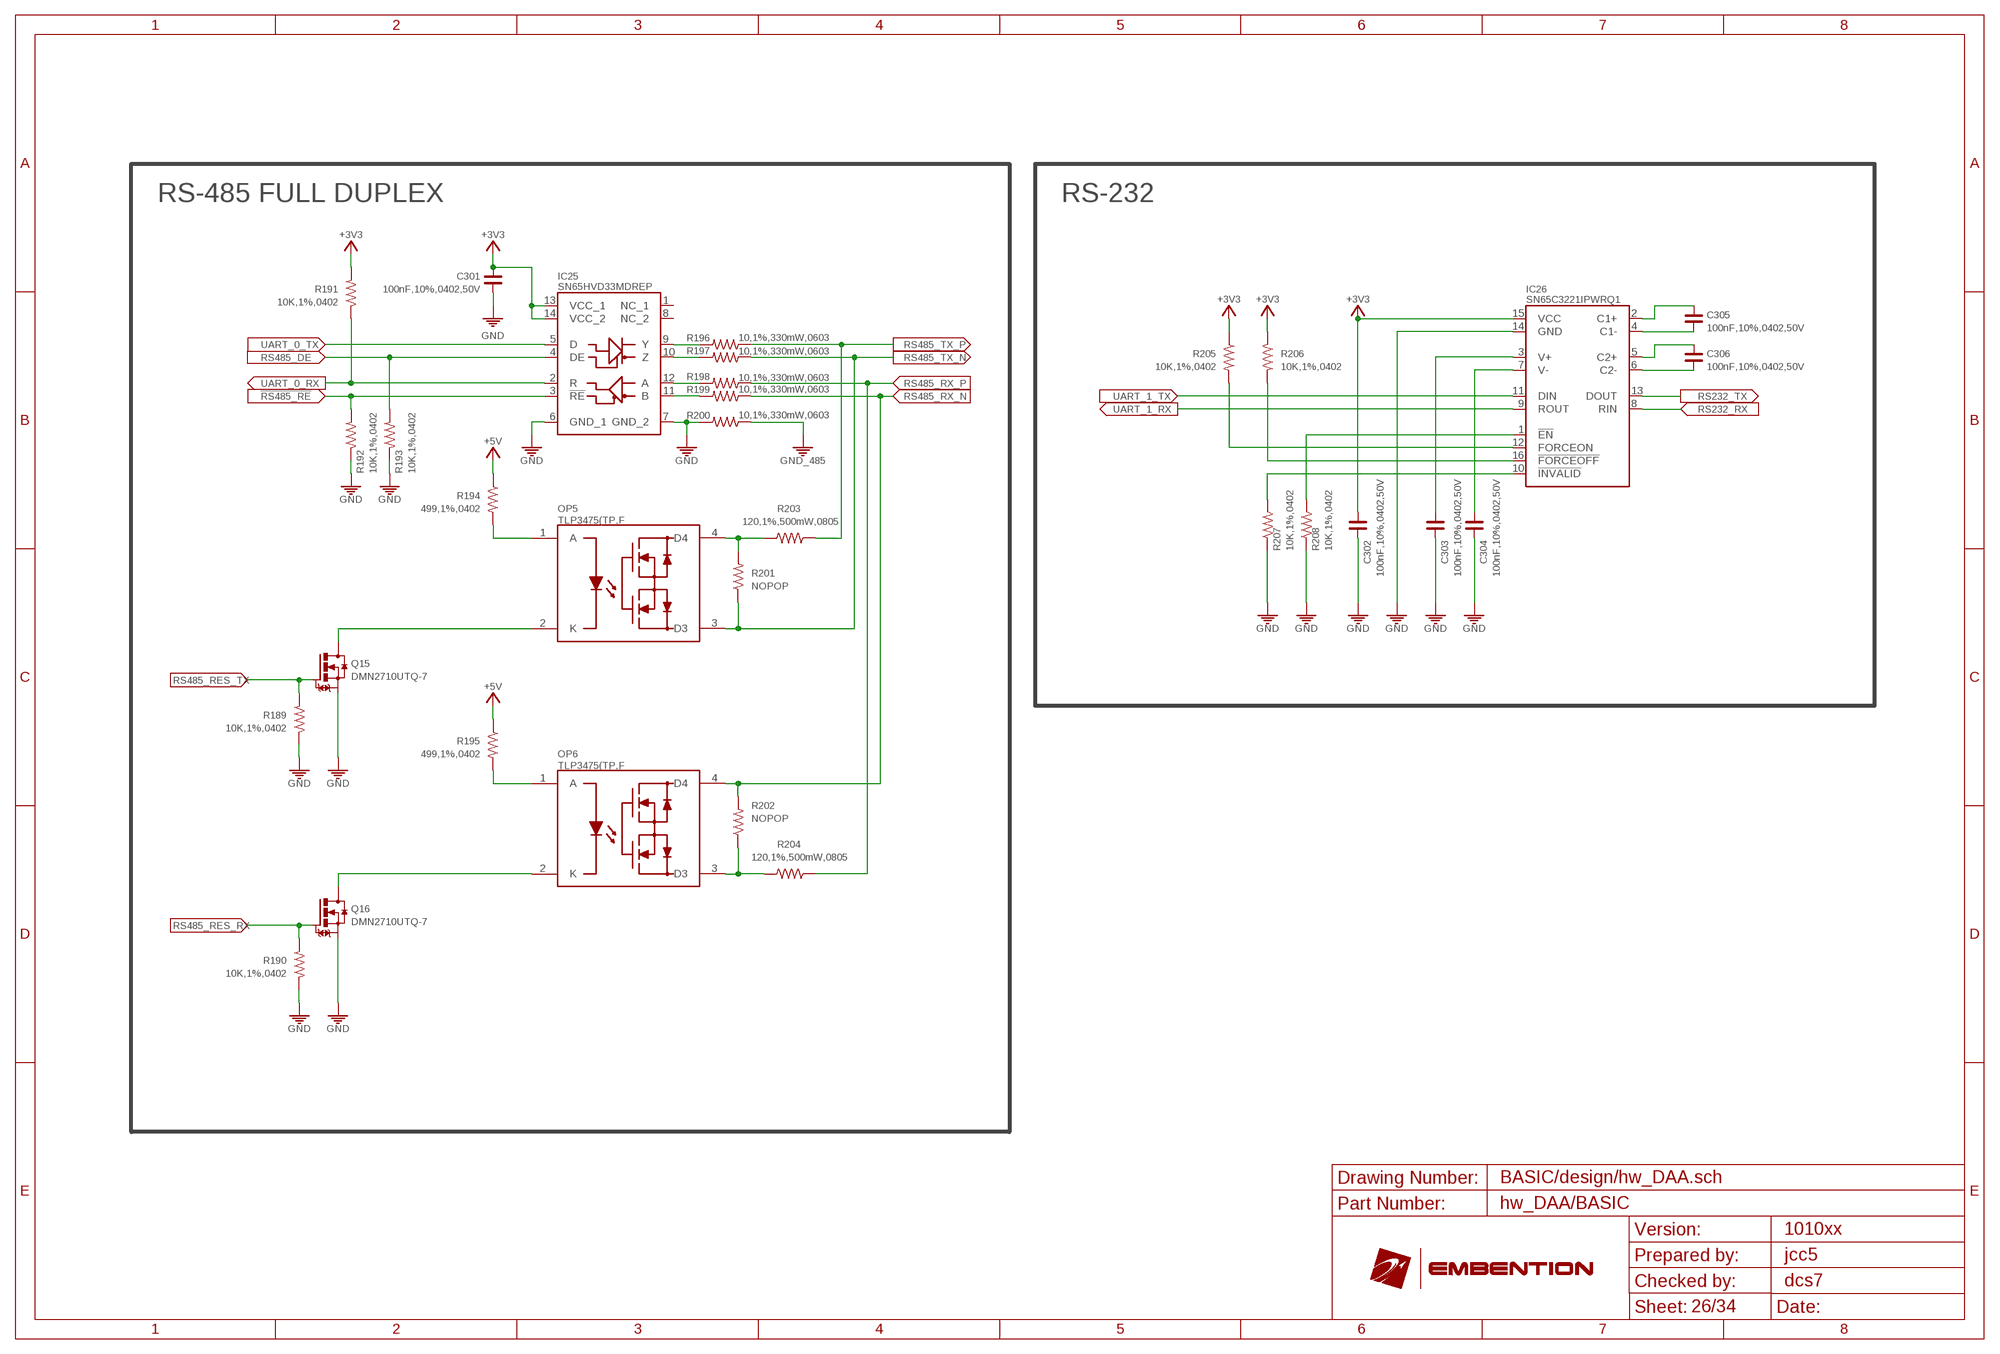
[diagram p25: schematic, sheet 26]

### Parts
C301  100nF,10%,0402,50V  C_0402  [C0402]
C302  100nF,10%,0402,50V  C_0402  [C0402]
C303  100nF,10%,0402,50V  C_0402  [C0402]
C304  100nF,10%,0402,50V  C_0402  [C0402]
C305  100nF,10%,0402,50V  C_0402  [C0402]
C306  100nF,10%,0402,50V  C_0402  [C0402]
IC25  SN65HVD33MDREP  SN65HVD33  [SOIC14_D_TEX]
IC26  SN65C3221IPWRQ1  SN65C3221-Q1  [TSSOP-16(TEXAS)]
OP5  TLP3475(TP,F  TLP3431  [VSON-4]
OP6  TLP3475(TP,F  TLP3431  [VSON-4]
Q15  DMN2710UTQ-7  [SOT-523]
Q16  DMN2710UTQ-7  [SOT-523]
R189  10K,1%,0402  R_0402  [R0402]
R190  10K,1%,0402  R_0402  [R0402]
R191  10K,1%,0402  R_0402  [R0402]
R192  10K,1%,0402  R_0402  [R0402]
R193  10K,1%,0402  R_0402  [R0402]
R194  499,1%,0402  R_0402  [R0402]
R195  499,1%,0402  R_0402  [R0402]
R196  10,1%,330mW,0603  R_0603  [R0603]
R197  10,1%,330mW,0603  R_0603  [R0603]
R198  10,1%,330mW,0603  R_0603  [R0603]
R199  10,1%,330mW,0603  R_0603  [R0603]
R200  10,1%,330mW,0603  R_0603  [R0603]
R201  NOPOP  R_0402  [R0402]
R202  NOPOP  R_0402  [R0402]
R203  120,1%,500mW,0805  R_0805  [R0805]
R204  120,1%,500mW,0805  R_0805  [R0805]
R205  10K,1%,0402  R_0402  [R0402]
R206  10K,1%,0402  R_0402  [R0402]
R207  10K,1%,0402  R_0402  [R0402]
R208  10K,1%,0402  R_0402  [R0402]

### Nets
!RS232_EN: IC26.1(!EN) R208.2
!RS232_FOFF: IC26.16(!FORCEOFF) R206.2
!RS232_INV: IC26.10(!INVALID) R207.2
!RS485_RE: IC25.3(!RE) R192.2 ; also sheet 19
+3V3: C301.1 C302.1 IC25.13(VCC_1) IC25.14(VCC_2) IC26.15(VCC) R191.2 R205.1 R206.1 ; also sheet 5,10,24,25
+5V: R194.1 R195.1 ; also sheet 3,4,5,7,8,25,33
GND: C301.2 C302.2 C303.2 C304.1 IC25.6(GND_1) IC25.7(GND_2) IC26.14(GND) Q15.2(S) Q16.2(S) R189.1 R190.1 R192.1 R193.1 R200.2 R207.1 R208.1 ; also sheet 2,3,4,5,6,7,8,9,10,11,12,13,14,15,17,18,20,21,22,23,24,25,27,28,29,30,31,32,33
GND_485: R200.1 ; also sheet 2
N$25: C305.1 IC26.2(C1+)
N$26: C305.2 IC26.4(C1-)
N$27: C306.2 IC26.5(C2+)
N$28: C306.1 IC26.6(C2-)
N$29: OP6.1(A) R195.2
N$30: C303.1 IC26.3(V+)
N$31: C304.2 IC26.7(V-)
N$32: OP5.1(A) R194.2
N$34: OP5.4(D4) R201.2 R203.1
N$41: OP5.2(K) Q15.3(D)
N$44: OP6.2(K) Q16.3(D)
N$112: OP6.3(D3) R202.1 R204.1
RS232_FON: IC26.12(FORCEON) R205.2
RS232_RX: IC26.8(RIN) ; also sheet 2
RS232_TX: IC26.13(DOUT) ; also sheet 2
RS485_DE: IC25.4(DE) R193.2 ; also sheet 19
RS485_RES_RX: Q16.1(G) R190.2 ; also sheet 19
RS485_RES_TX: Q15.1(G) R189.2 ; also sheet 19
RS485_RX_N [DIFF120]: OP6.4(D4) R199.1 R202.2 ; also sheet 2
RS485_RX_P [DIFF120]: R198.1 R204.2 ; also sheet 2
RS485_RXD_N: IC25.11(B) R199.2
RS485_RXD_P: IC25.12(A) R198.2
RS485_TX_N [DIFF120]: OP5.3(D3) R197.1 R201.1 ; also sheet 2
RS485_TX_P [DIFF120]: R196.1 R203.2 ; also sheet 2
RS485_TXD_N: IC25.10(Z) R197.2
RS485_TXD_P: IC25.9(Y) R196.2
UART_0_RX: IC25.2(R) R191.1 ; also sheet 19
UART_0_TX: IC25.5(D) ; also sheet 19
UART_1_RX: IC26.9(ROUT) ; also sheet 19
UART_1_TX: IC26.11(DIN) ; also sheet 19
Unconnected: IC25.1(NC_1) IC25.8(NC_2)

### Notes on the sheet
- RS-485 FULL DUPLEX | RS-232
- BASIC/design/hw_DAA.sch
- hw_DAA/BASIC
- 1010xx
- jcc5
- dcs7

## Sheet 27 of 34: Ethernet
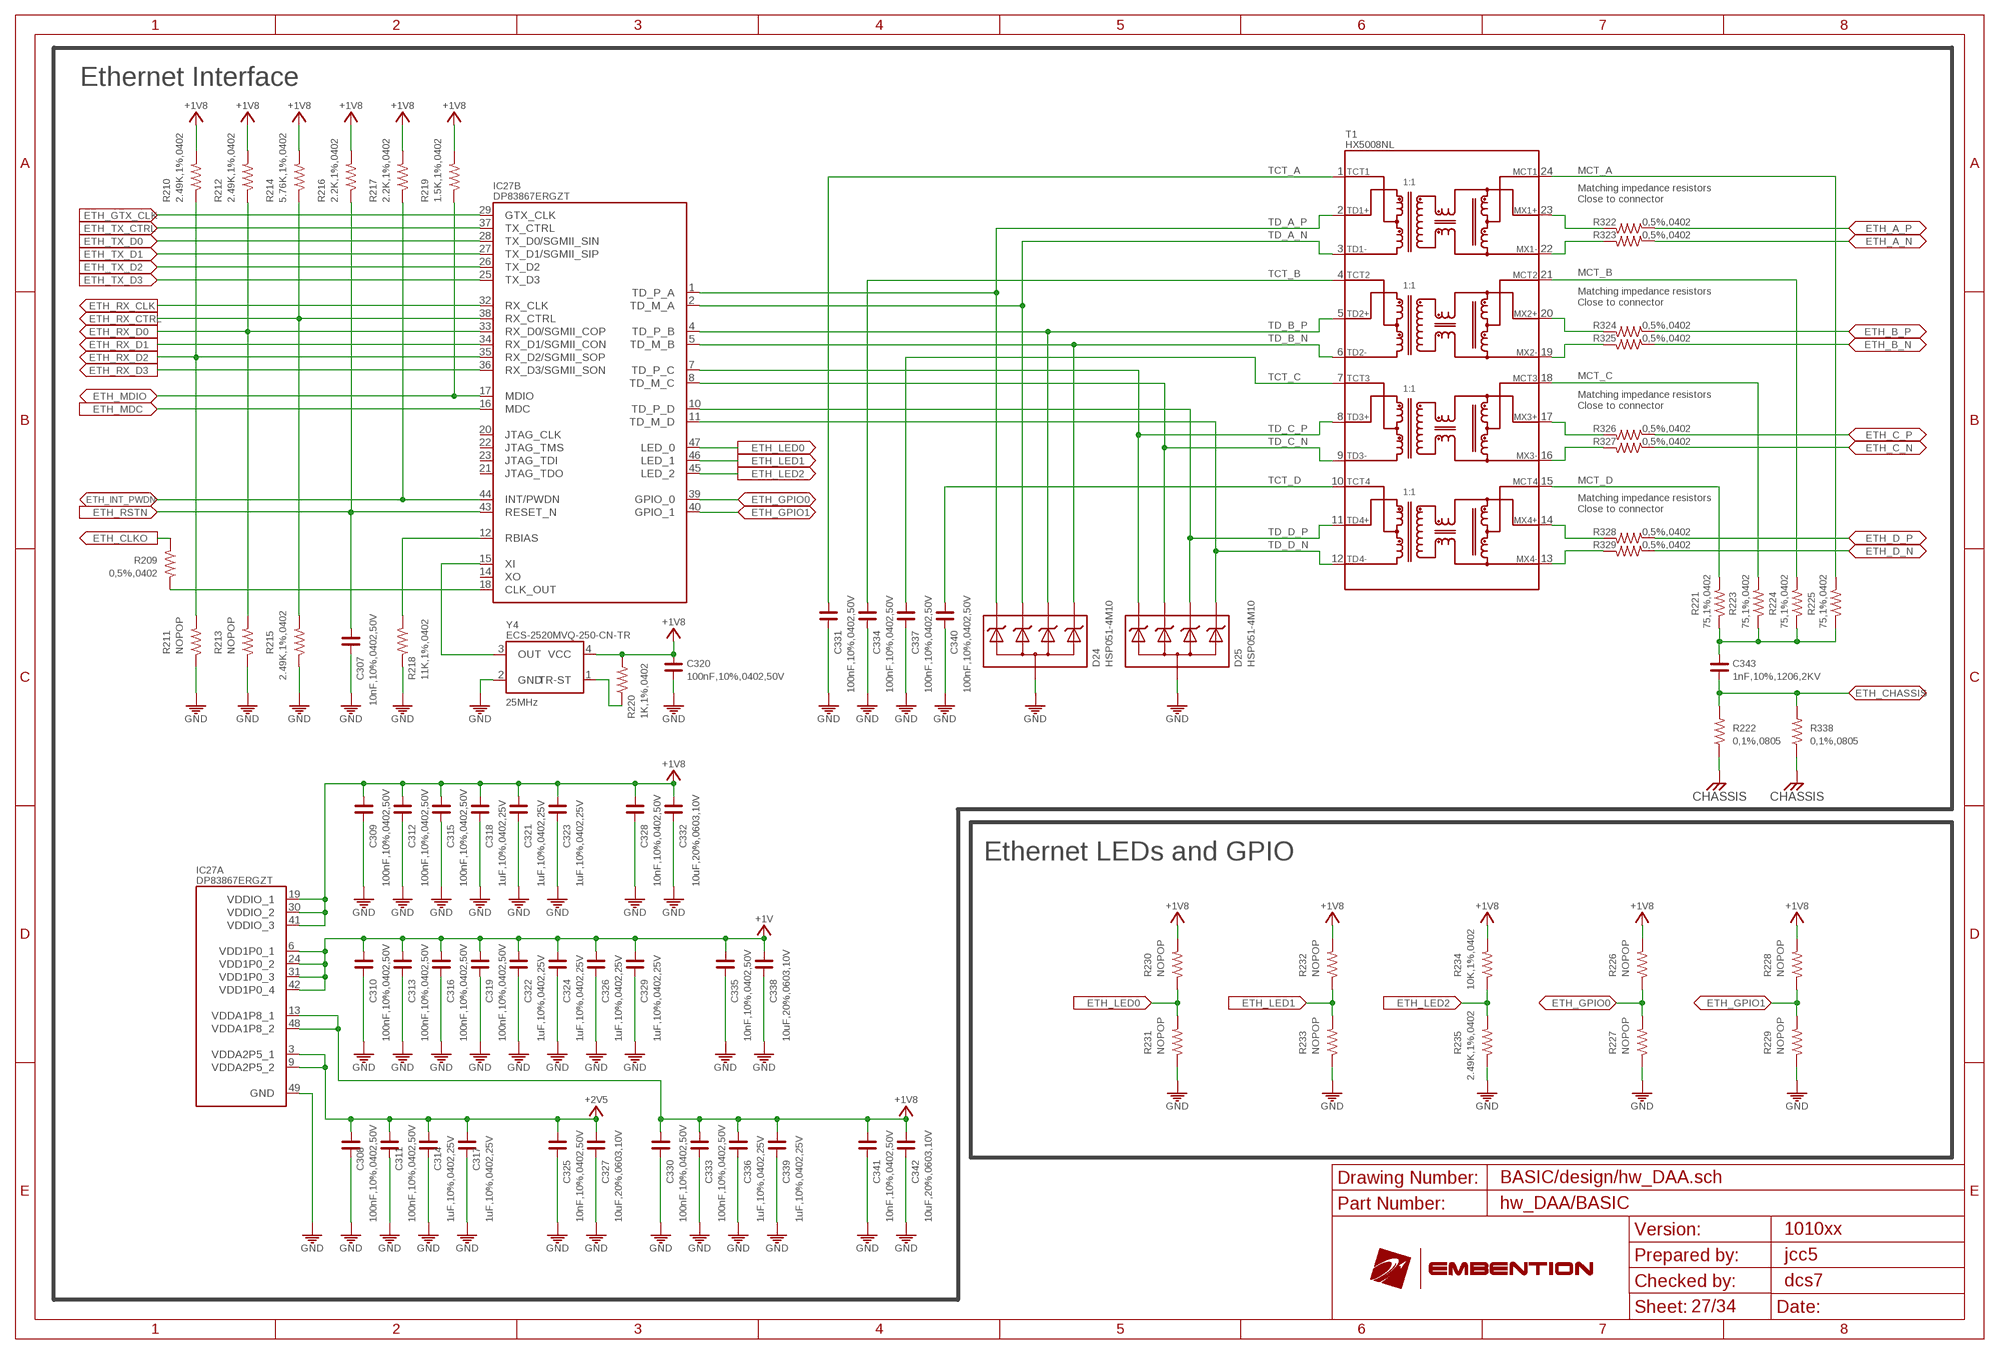
[diagram p26: schematic, sheet 27]

### Parts
C307  10nF,10%,0402,50V  C_0402  [C0402]
C308  100nF,10%,0402,50V  C_0402  [C0402]
C309  100nF,10%,0402,50V  C_0402  [C0402]
C310  100nF,10%,0402,50V  C_0402  [C0402]
C311  100nF,10%,0402,50V  C_0402  [C0402]
C312  100nF,10%,0402,50V  C_0402  [C0402]
C313  100nF,10%,0402,50V  C_0402  [C0402]
C314  1uF,10%,0402,25V  C_0402  [C0402]
C315  100nF,10%,0402,50V  C_0402  [C0402]
C316  100nF,10%,0402,50V  C_0402  [C0402]
C317  1uF,10%,0402,25V  C_0402  [C0402]
C318  1uF,10%,0402,25V  C_0402  [C0402]
C319  100nF,10%,0402,50V  C_0402  [C0402]
C320  100nF,10%,0402,50V  C_0402  [C0402]
C321  1uF,10%,0402,25V  C_0402  [C0402]
C322  1uF,10%,0402,25V  C_0402  [C0402]
C323  1uF,10%,0402,25V  C_0402  [C0402]
C324  1uF,10%,0402,25V  C_0402  [C0402]
C325  10nF,10%,0402,50V  C_0402  [C0402]
C326  1uF,10%,0402,25V  C_0402  [C0402]
C327  10uF,20%,0603,10V  C_0603  [C0603]
C328  10nF,10%,0402,50V  C_0402  [C0402]
C329  1uF,10%,0402,25V  C_0402  [C0402]
C330  100nF,10%,0402,50V  C_0402  [C0402]
C331  100nF,10%,0402,50V  C_0402  [C0402]
C332  10uF,20%,0603,10V  C_0603  [C0603]
C333  100nF,10%,0402,50V  C_0402  [C0402]
C334  100nF,10%,0402,50V  C_0402  [C0402]
C335  10nF,10%,0402,50V  C_0402  [C0402]
C336  1uF,10%,0402,25V  C_0402  [C0402]
C337  100nF,10%,0402,50V  C_0402  [C0402]
C338  10uF,20%,0603,10V  C_0603  [C0603]
C339  1uF,10%,0402,25V  C_0402  [C0402]
C340  100nF,10%,0402,50V  C_0402  [C0402]
C341  10nF,10%,0402,50V  C_0402  [C0402]
C342  10uF,20%,0603,10V  C_0603  [C0603]
C343  1nF,10%,1206,2KV  C_1206  [C1206]
D24  HSP051-4M10  HSP051-4M10CN  [USON-10]
D25  HSP051-4M10  HSP051-4M10CN  [USON-10]
IC27  DP83867ERGZT  DP83867ERGZ  [VQFN-48]
R209  0,5%,0402  R_0402  [R0402]
R210  2.49K,1%,0402  R_0402  [R0402]
R211  NOPOP  R_0402  [R0402]
R212  2.49K,1%,0402  R_0402  [R0402]
R213  NOPOP  R_0402  [R0402]
R214  5.76K,1%,0402  R_0402  [R0402]
R215  2.49K,1%,0402  R_0402  [R0402]
R216  2.2K,1%,0402  R_0402  [R0402]
R217  2.2K,1%,0402  R_0402  [R0402]
R218  11K,1%,0402  R_0402  [R0402]
R219  1.5K,1%,0402  R_0402  [R0402]
R220  1K,1%,0402  R_0402  [R0402]
R221  75,1%,0402  R_0402  [R0402]
R222  0,1%,0805  R_0805  [R0805]
R223  75,1%,0402  R_0402  [R0402]
R224  75,1%,0402  R_0402  [R0402]
R225  75,1%,0402  R_0402  [R0402]
R226  NOPOP  R_0402  [R0402]
R227  NOPOP  R_0402  [R0402]
R228  NOPOP  R_0402  [R0402]
R229  NOPOP  R_0402  [R0402]
R230  NOPOP  R_0402  [R0402]
R231  NOPOP  R_0402  [R0402]
R232  NOPOP  R_0402  [R0402]
R233  NOPOP  R_0402  [R0402]
R234  10K,1%,0402  R_0402  [R0402]
R235  2.49K,1%,0402  R_0402  [R0402]
R322  0,5%,0402  R_0402  [R0402]
R323  0,5%,0402  R_0402  [R0402]
R324  0,5%,0402  R_0402  [R0402]
R325  0,5%,0402  R_0402  [R0402]
R326  0,5%,0402  R_0402  [R0402]
R327  0,5%,0402  R_0402  [R0402]
R328  0,5%,0402  R_0402  [R0402]
R329  0,5%,0402  R_0402  [R0402]
R338  0,1%,0805  R_0805  [R0805]
T1  HX5008NL  [HX5008NL]
Y4  ECS-2520MVQ-250-CN-TR  [ECS-2520MVQ]

### Nets
+1V: C310.1 C313.1 C316.1 C319.1 C322.1 C324.1 C326.1 C329.1 C335.1 C338.1 IC27.6(A:VDD1P0_1) IC27.24(A:VDD1P0_2) IC27.31(A:VDD1P0_3) IC27.42(A:VDD1P0_4) ; also sheet 5
+1V8: C309.1 C312.1 C315.1 C318.1 C320.1 C321.1 C323.1 C328.1 C330.1 C332.1 C333.1 C336.1 C339.1 C341.1 C342.1 IC27.13(A:VDDA1P8_1) IC27.19(A:VDDIO_1) IC27.30(A:VDDIO_2) IC27.41(A:VDDIO_3) IC27.48(A:VDDA1P8_2) R210.2 R212.2 R214.2 R216.2 R217.2 R219.2 R220.2 R226.2 R228.2 R230.2 R232.2 R234.2 Y4.4(VCC) ; also sheet 5,24,33
+2V5: C308.1 C311.1 C314.1 C317.1 C325.1 C327.1 IC27.3(A:VDDA2P5_1) IC27.9(A:VDDA2P5_2) ; also sheet 10
CHASSIS: R222.1 R338.1 ; also sheet 2
ETH_25MHZ_EN: R220.1 Y4.1(TR-ST)
ETH_A_N [DIFF100]: R323.1 ; also sheet 2
ETH_A_P [DIFF100]: R322.1 ; also sheet 2
ETH_B_N [DIFF100]: R325.1 ; also sheet 2
ETH_B_P [DIFF100]: R324.1 ; also sheet 2
ETH_C_N [DIFF100]: R327.1 ; also sheet 2
ETH_C_P [DIFF100]: R326.1 ; also sheet 2
ETH_CHASSIS: C343.2 R222.2 R338.2 ; also sheet 2
ETH_CHS: C343.1 R221.1 R223.1 R224.1 R225.1
ETH_CLK_OUT: IC27.18(B:CLK_OUT) R209.2
ETH_CLKO: R209.1 ; also sheet 16
ETH_D_N [DIFF100]: R329.1 ; also sheet 2
ETH_D_P [DIFF100]: R328.1 ; also sheet 2
ETH_GPIO0: IC27.39(B:GPIO_0) R226.1 R227.2 ; also sheet 19
ETH_GPIO1: IC27.40(B:GPIO_1) R228.1 R229.2 ; also sheet 19
ETH_GTX_CLK: IC27.29(B:GTX_CLK) ; also sheet 19
ETH_INT_PWDN: IC27.44(B:INT/PWDN) R217.1 ; also sheet 19
ETH_LED0: IC27.47(B:LED_0) R230.1 R231.2
ETH_LED1: IC27.46(B:LED_1) R232.1 R233.2
ETH_LED2: IC27.45(B:LED_2) R234.1 R235.2
ETH_MDC: IC27.16(B:MDC) ; also sheet 19
ETH_MDIO: IC27.17(B:MDIO) R219.1 ; also sheet 19
ETH_RBIAS: IC27.12(B:RBIAS) R218.1
ETH_RSTN: C307.1 IC27.43(B:RESET_N) R216.1 ; also sheet 19
ETH_RX_CLK: IC27.32(B:RX_CLK) ; also sheet 19
ETH_RX_CTRL: IC27.38(B:RX_CTRL) R214.1 R215.2 ; also sheet 19
ETH_RX_D0: IC27.33(B:RX_D0/SGMII_COP) R212.1 R213.2 ; also sheet 19
ETH_RX_D1: IC27.34(B:RX_D1/SGMII_CON) ; also sheet 19
ETH_RX_D2: IC27.35(B:RX_D2/SGMII_SOP) R210.1 R211.2 ; also sheet 19
ETH_RX_D3: IC27.36(B:RX_D3/SGMII_SON) ; also sheet 19
ETH_TX_CTRL: IC27.37(B:TX_CTRL) ; also sheet 19
ETH_TX_D0: IC27.28(B:TX_D0/SGMII_SIN) ; also sheet 19
ETH_TX_D1: IC27.27(B:TX_D1/SGMII_SIP) ; also sheet 19
ETH_TX_D2: IC27.26(B:TX_D2) ; also sheet 19
ETH_TX_D3: IC27.25(B:TX_D3) ; also sheet 19
ETH_XI: IC27.15(B:XI) Y4.3(OUT)
GND: C307.2 C308.2 C309.2 C310.2 C311.2 C312.2 C313.2 C314.2 C315.2 C316.2 C317.2 C318.2 C319.2 C320.2 C321.2 C322.2 C323.2 C324.2 C325.2 C326.2 C327.2 C328.2 C329.2 C330.2 C331.2 C332.2 C333.2 C334.2 C335.2 C336.2 C337.2 C338.2 C339.2 C340.2 C341.2 C342.2 D24.3 D24.8 D24.38 D25.3 D25.8 D25.38 IC27.49(A:GND) R211.1 R213.1 R215.1 R218.2 R227.1 R229.1 R231.1 R233.1 R235.1 Y4.2(GND) ; also sheet 2,3,4,5,6,7,8,9,10,11,12,13,14,15,17,18,20,21,22,23,24,25,26,28,29,30,31,32,33
MCT_A: R225.2 T1.24(MCT1)
MCT_B: R224.2 T1.21(MCT2)
MCT_C: R223.2 T1.18(MCT3)
MCT_D: R221.2 T1.15(MCT4)
MX_A_N [DIFF100]: R323.2 T1.22(MX1-)
MX_A_P [DIFF100]: R322.2 T1.23(MX1+)
MX_B_N [DIFF100]: R325.2 T1.19(MX2-)
MX_B_P [DIFF100]: R324.2 T1.20(MX2+)
MX_C_N [DIFF100]: R327.2 T1.16(MX3-)
MX_C_P [DIFF100]: R326.2 T1.17(MX3+)
MX_D_N [DIFF100]: R329.2 T1.13(MX4-)
MX_D_P [DIFF100]: R328.2 T1.14(MX4+)
TCT_A: C331.1 T1.1(TCT1)
TCT_B: C334.1 T1.4(TCT2)
TCT_C: C337.1 T1.7(TCT3)
TCT_D: C340.1 T1.10(TCT4)
TD_A_N [DIFF100]: D24.2 D24.9 IC27.2(B:TD_M_A) T1.3(TD1-)
TD_A_P [DIFF100]: D24.1 D24.10 IC27.1(B:TD_P_A) T1.2(TD1+)
TD_B_N [DIFF100]: D24.5 D24.6 IC27.5(B:TD_M_B) T1.6(TD2-)
TD_B_P [DIFF100]: D24.4 D24.7 IC27.4(B:TD_P_B) T1.5(TD2+)
TD_C_N [DIFF100]: D25.2 D25.9 IC27.8(B:TD_M_C) T1.9(TD3-)
TD_C_P [DIFF100]: D25.1 D25.10 IC27.7(B:TD_P_C) T1.8(TD3+)
TD_D_N [DIFF100]: D25.5 D25.6 IC27.11(B:TD_M_D) T1.12(TD4-)
TD_D_P [DIFF100]: D25.4 D25.7 IC27.10(B:TD_P_D) T1.11(TD4+)
Unconnected: IC27.14(B:XO) IC27.20(B:JTAG_CLK) IC27.21(B:JTAG_TDO) IC27.22(B:JTAG_TMS) IC27.23(B:JTAG_TDI)

### Notes on the sheet
- Ethernet Interface
- Matching impedance resistors
  Close to connector
- Matching impedance resistors
  Close to connector
- Matching impedance resistors
  Close to connector
- Matching impedance resistors
  Close to connector
- 25MHz
- Ethernet LEDs and GPIO
- BASIC/design/hw_DAA.sch
- hw_DAA/BASIC
- 1010xx
- jcc5
- dcs7

## Sheet 28 of 34: Image Sensor
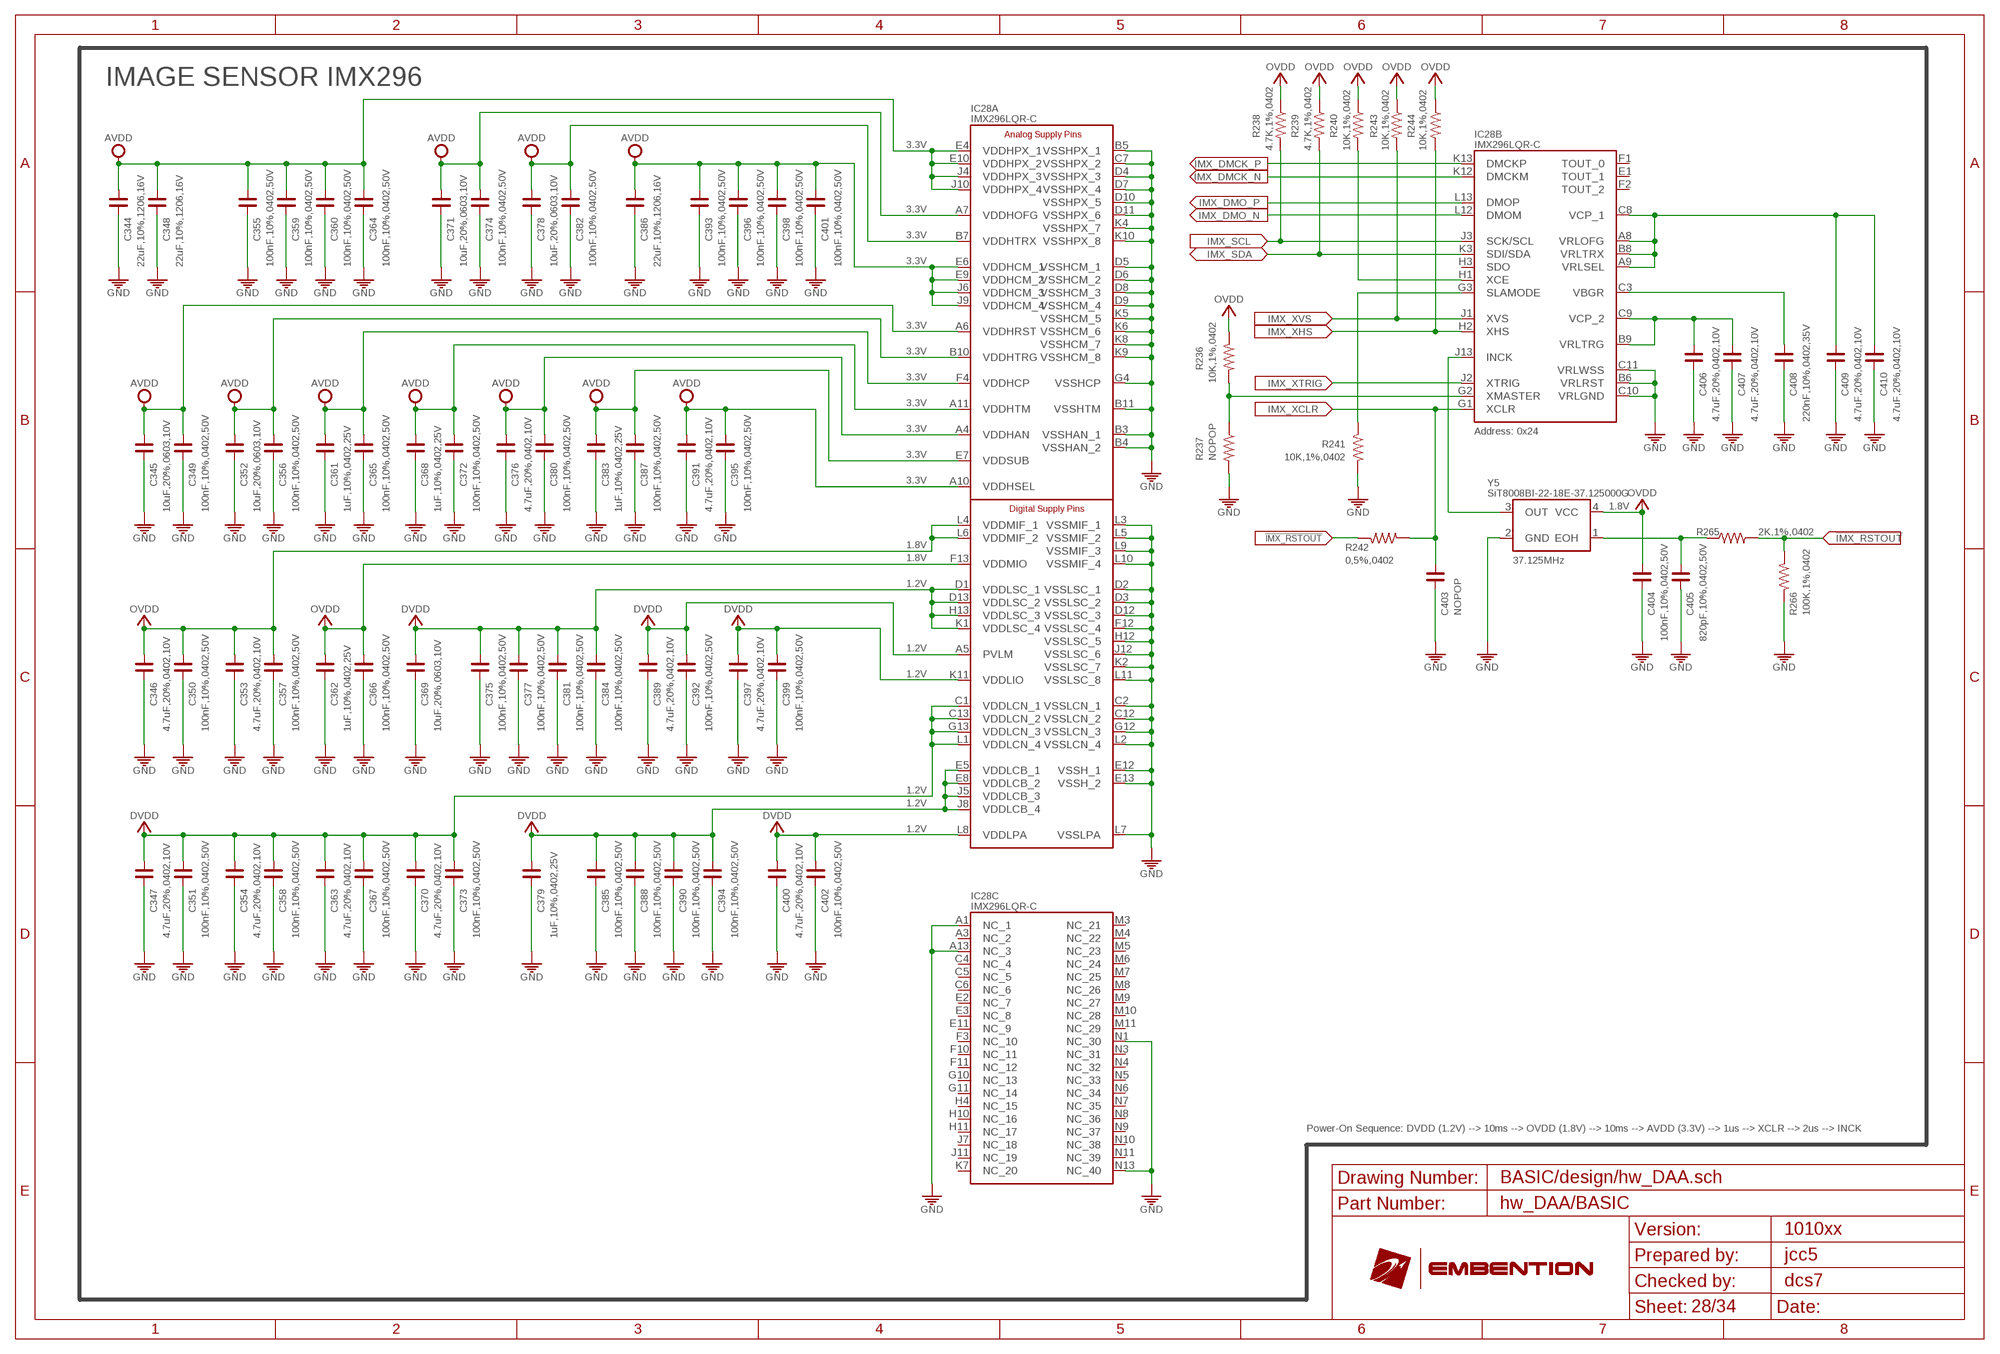
[diagram p27: schematic, sheet 28]

### Parts
C344  22uF,10%,1206,16V  C_1206  [C1206]
C345  10uF,20%,0603,10V  C_0603  [C0603]
C346  4.7uF,20%,0402,10V  C_0402  [C0402]
C347  4.7uF,20%,0402,10V  C_0402  [C0402]
C348  22uF,10%,1206,16V  C_1206  [C1206]
C349  100nF,10%,0402,50V  C_0402  [C0402]
C350  100nF,10%,0402,50V  C_0402  [C0402]
C351  100nF,10%,0402,50V  C_0402  [C0402]
C352  10uF,20%,0603,10V  C_0603  [C0603]
C353  4.7uF,20%,0402,10V  C_0402  [C0402]
C354  4.7uF,20%,0402,10V  C_0402  [C0402]
C355  100nF,10%,0402,50V  C_0402  [C0402]
C356  100nF,10%,0402,50V  C_0402  [C0402]
C357  100nF,10%,0402,50V  C_0402  [C0402]
C358  100nF,10%,0402,50V  C_0402  [C0402]
C359  100nF,10%,0402,50V  C_0402  [C0402]
C360  100nF,10%,0402,50V  C_0402  [C0402]
C361  1uF,10%,0402,25V  C_0402  [C0402]
C362  1uF,10%,0402,25V  C_0402  [C0402]
C363  4.7uF,20%,0402,10V  C_0402  [C0402]
C364  100nF,10%,0402,50V  C_0402  [C0402]
C365  100nF,10%,0402,50V  C_0402  [C0402]
C366  100nF,10%,0402,50V  C_0402  [C0402]
C367  100nF,10%,0402,50V  C_0402  [C0402]
C368  1uF,10%,0402,25V  C_0402  [C0402]
C369  10uF,20%,0603,10V  C_0603  [C0603]
C370  4.7uF,20%,0402,10V  C_0402  [C0402]
C371  10uF,20%,0603,10V  C_0603  [C0603]
C372  100nF,10%,0402,50V  C_0402  [C0402]
C373  100nF,10%,0402,50V  C_0402  [C0402]
C374  100nF,10%,0402,50V  C_0402  [C0402]
C375  100nF,10%,0402,50V  C_0402  [C0402]
C376  4.7uF,20%,0402,10V  C_0402  [C0402]
C377  100nF,10%,0402,50V  C_0402  [C0402]
C378  10uF,20%,0603,10V  C_0603  [C0603]
C379  1uF,10%,0402,25V  C_0402  [C0402]
C380  100nF,10%,0402,50V  C_0402  [C0402]
C381  100nF,10%,0402,50V  C_0402  [C0402]
C382  100nF,10%,0402,50V  C_0402  [C0402]
C383  1uF,10%,0402,25V  C_0402  [C0402]
C384  100nF,10%,0402,50V  C_0402  [C0402]
C385  100nF,10%,0402,50V  C_0402  [C0402]
C386  22uF,10%,1206,16V  C_1206  [C1206]
C387  100nF,10%,0402,50V  C_0402  [C0402]
C388  100nF,10%,0402,50V  C_0402  [C0402]
C389  4.7uF,20%,0402,10V  C_0402  [C0402]
C390  100nF,10%,0402,50V  C_0402  [C0402]
C391  4.7uF,20%,0402,10V  C_0402  [C0402]
C392  100nF,10%,0402,50V  C_0402  [C0402]
C393  100nF,10%,0402,50V  C_0402  [C0402]
C394  100nF,10%,0402,50V  C_0402  [C0402]
C395  100nF,10%,0402,50V  C_0402  [C0402]
C396  100nF,10%,0402,50V  C_0402  [C0402]
C397  4.7uF,20%,0402,10V  C_0402  [C0402]
C398  100nF,10%,0402,50V  C_0402  [C0402]
C399  100nF,10%,0402,50V  C_0402  [C0402]
C400  4.7uF,20%,0402,10V  C_0402  [C0402]
C401  100nF,10%,0402,50V  C_0402  [C0402]
C402  100nF,10%,0402,50V  C_0402  [C0402]
C403  NOPOP  C_0402  [C0402]
C404  100nF,10%,0402,50V  C_0402  [C0402]
C405  820pF,10%,0402,50V  C_0402  [C0402]
C406  4.7uF,20%,0402,10V  C_0402  [C0402]
C407  4.7uF,20%,0402,10V  C_0402  [C0402]
C408  220nF,10%,0402,35V  C_0402  [C0402]
C409  4.7uF,20%,0402,10V  C_0402  [C0402]
C410  4.7uF,20%,0402,10V  C_0402  [C0402]
IC28  IMX296LQR-C  IMX296NSMD  [LGA-138_NSMD]
R236  10K,1%,0402  R_0402  [R0402]
R237  NOPOP  R_0402  [R0402]
R238  4.7K,1%,0402  R_0402  [R0402]
R239  4.7K,1%,0402  R_0402  [R0402]
R240  10K,1%,0402  R_0402  [R0402]
R241  10K,1%,0402  R_0402  [R0402]
R242  0,5%,0402  R_0402  [R0402]
R243  10K,1%,0402  R_0402  [R0402]
R244  10K,1%,0402  R_0402  [R0402]
R265  2K,1%,0402  R_0402  [R0402]
R266  100K,1%,0402  R_0402  [R0402]
Y5  SiT8008BI-22-18E-37.125000G  SIT8008BI-22-18E-37.125000  [3.2X2.5]

### Nets
!IMX_RSTOUT: R242.2 R265.2 R266.1 ; also sheet 9
AVDD: C344.1 C345.1 C348.1 C349.1 C352.1 C355.1 C356.1 C359.1 C360.1 C361.1 C364.1 C365.1 C368.1 C371.1 C372.1 C374.1 C376.1 C378.1 C380.1 C382.1 C383.1 C386.1 C387.1 C391.1 C393.1 C395.1 C396.1 C398.1 C401.1 IC28.A4(A:VDDHAN) IC28.A6(A:VDDHRST) IC28.A7(A:VDDHOFG) IC28.A10(A:VDDHSEL) IC28.A11(A:VDDHTM) IC28.B7(A:VDDHTRX) IC28.B10(A:VDDHTRG) IC28.E4(A:VDDHPX_1) IC28.E6(A:VDDHCM_1) IC28.E7(A:VDDSUB) IC28.E9(A:VDDHCM_2) IC28.E10(A:VDDHPX_2) IC28.F4(A:VDDHCP) IC28.J4(A:VDDHPX_3) IC28.J6(A:VDDHCM_3) IC28.J9(A:VDDHCM_4) IC28.J10(A:VDDHPX_4) ; also sheet 9,29,30
DVDD: C347.1 C351.1 C354.1 C358.1 C363.1 C367.1 C369.1 C370.1 C373.1 C375.1 C377.1 C379.1 C381.1 C384.1 C385.1 C388.1 C389.1 C390.1 C392.1 C394.1 C397.1 C399.1 C400.1 C402.1 IC28.A5(A:PVLM) IC28.C1(A:VDDLCN_1) IC28.C13(A:VDDLCN_2) IC28.D1(A:VDDLSC_1) IC28.D13(A:VDDLSC_2) IC28.E5(A:VDDLCB_1) IC28.E8(A:VDDLCB_2) IC28.G13(A:VDDLCN_3) IC28.H13(A:VDDLSC_3) IC28.J5(A:VDDLCB_3) IC28.J8(A:VDDLCB_4) IC28.K1(A:VDDLSC_4) IC28.K11(A:VDDLIO) IC28.L1(A:VDDLCN_4) IC28.L8(A:VDDLPA) ; also sheet 9
GND: C344.2 C345.2 C346.2 C347.2 C348.2 C349.2 C350.2 C351.2 C352.2 C353.2 C354.2 C355.2 C356.2 C357.2 C358.2 C359.2 C360.2 C361.2 C362.2 C363.2 C364.2 C365.2 C366.2 C367.2 C368.2 C369.2 C370.2 C371.2 C372.2 C373.2 C374.2 C375.2 C376.2 C377.2 C378.2 C379.2 C380.2 C381.2 C382.2 C383.2 C384.2 C385.2 C386.2 C387.2 C388.2 C389.2 C390.2 C391.2 C392.2 C393.2 C394.2 C395.2 C396.2 C397.2 C398.2 C399.2 C400.2 C401.2 C402.2 C403.2 C404.2 C405.2 C406.2 C407.2 C408.2 C409.2 C410.2 IC28.A1(C:NC_1) IC28.A13(C:NC_3) IC28.B3(A:VSSHAN_1) IC28.B4(A:VSSHAN_2) IC28.B5(A:VSSHPX_1) IC28.B6(B:VRLRST) IC28.B11(A:VSSHTM) IC28.C2(A:VSSLCN_1) IC28.C7(A:VSSHPX_2) IC28.C10(B:VRLGND) IC28.C11(B:VRLWSS) IC28.C12(A:VSSLCN_2) IC28.D2(A:VSSLSC_1) IC28.D3(A:VSSLSC_2) IC28.D4(A:VSSHPX_3) IC28.D5(A:VSSHCM_1) IC28.D6(A:VSSHCM_2) IC28.D7(A:VSSHPX_4) IC28.D8(A:VSSHCM_3) IC28.D9(A:VSSHCM_4) IC28.D10(A:VSSHPX_5) IC28.D11(A:VSSHPX_6) IC28.D12(A:VSSLSC_3) IC28.E12(A:VSSH_1) IC28.E13(A:VSSH_2) IC28.F12(A:VSSLSC_4) IC28.G4(A:VSSHCP) IC28.G12(A:VSSLCN_3) IC28.H12(A:VSSLSC_5) IC28.J12(A:VSSLSC_6) IC28.K2(A:VSSLSC_7) IC28.K4(A:VSSHPX_7) IC28.K5(A:VSSHCM_5) IC28.K6(A:VSSHCM_6) IC28.K8(A:VSSHCM_7) IC28.K9(A:VSSHCM_8) IC28.K10(A:VSSHPX_8) IC28.L2(A:VSSLCN_4) IC28.L3(A:VSSMIF_1) IC28.L5(A:VSSMIF_2) IC28.L7(A:VSSLPA) IC28.L9(A:VSSMIF_3) IC28.L10(A:VSSMIF_4) IC28.L11(A:VSSLSC_8) IC28.N1(C:NC_30) IC28.N13(C:NC_40) R237.2 R241.2 R266.2 Y5.2(GND) ; also sheet 2,3,4,5,6,7,8,9,10,11,12,13,14,15,17,18,20,21,22,23,24,25,26,27,29,30,31,32,33
IMX_DMCK_N [DIFF100]: IC28.K12(B:DMCKM) ; also sheet 29
IMX_DMCK_P [DIFF100]: IC28.K13(B:DMCKP) ; also sheet 29
IMX_DMO_N [DIFF100]: IC28.L12(B:DMOM) ; also sheet 29
IMX_DMO_P [DIFF100]: IC28.L13(B:DMOP) ; also sheet 29
IMX_EN_CLK: C405.1 R265.1 Y5.1(EOH)
IMX_INCK: IC28.J13(B:INCK) Y5.3(OUT)
IMX_SCL: IC28.J3(B:SCK/SCL) R238.2 ; also sheet 29,30
IMX_SDA: IC28.K3(B:SDI/SDA) R239.2 ; also sheet 29,30
IMX_VBGR: C408.1 IC28.C3(B:VBGR)
IMX_VCP_1: C409.1 C410.1 IC28.A8(B:VRLOFG) IC28.A9(B:VRLSEL) IC28.B8(B:VRLTRX) IC28.C8(B:VCP_1)
IMX_VCP_2: C406.1 C407.1 IC28.B9(B:VRLTRG) IC28.C9(B:VCP_2)
IMX_XCLR: C403.1 IC28.G1(B:XCLR) R242.1 ; also sheet 29
IMX_XHS: IC28.H2(B:XHS) R244.2 ; also sheet 29
IMX_XMASTER: IC28.G2(B:XMASTER) R236.2 R237.1
IMX_XTRIG: IC28.J2(B:XTRIG) ; also sheet 29,30
IMX_XVS: IC28.J1(B:XVS) R243.2 ; also sheet 29
N$17: IC28.G3(B:SLAMODE) R241.1
OVDD: C346.1 C350.1 C353.1 C357.1 C362.1 C366.1 C404.1 IC28.F13(A:VDDMIO) IC28.L4(A:VDDMIF_1) IC28.L6(A:VDDMIF_2) R236.1 R238.1 R239.1 R240.1 R243.1 R244.1 Y5.4(VCC) ; also sheet 9,29,30,31,32
SPI_0_SS: IC28.H1(B:XCE) R240.2
Unconnected: IC28.A3(C:NC_2) IC28.C4(C:NC_4) IC28.C5(C:NC_5) IC28.C6(C:NC_6) IC28.E1(B:TOUT_1) IC28.E2(C:NC_7) IC28.E3(C:NC_8) IC28.E11(C:NC_9) IC28.F1(B:TOUT_0) IC28.F2(B:TOUT_2) IC28.F3(C:NC_10) IC28.F10(C:NC_11) IC28.F11(C:NC_12) IC28.G10(C:NC_13) IC28.G11(C:NC_14) IC28.H3(B:SDO) IC28.H4(C:NC_15) IC28.H10(C:NC_16) IC28.H11(C:NC_17) IC28.J7(C:NC_18) IC28.J11(C:NC_19) IC28.K7(C:NC_20) IC28.M3(C:NC_21) IC28.M4(C:NC_22) IC28.M5(C:NC_23) IC28.M6(C:NC_24) IC28.M7(C:NC_25) IC28.M8(C:NC_26) IC28.M9(C:NC_27) IC28.M10(C:NC_28) IC28.M11(C:NC_29) IC28.N3(C:NC_31) IC28.N4(C:NC_32) IC28.N5(C:NC_33) IC28.N6(C:NC_34) IC28.N7(C:NC_35) IC28.N8(C:NC_36) IC28.N9(C:NC_37) IC28.N10(C:NC_38) IC28.N11(C:NC_39)

### Notes on the sheet
- IMAGE SENSOR IMX296
- 3.3V
- 3.3V
- 3.3V
- 3.3V
- 3.3V
- 3.3V
- 3.3V
- 3.3V
- 3.3V | Address: 0x24
- 3.3V
- 3.3V
- 1.8V
- 1.8V
- 1.8V | 37.125MHz
- 1.2V
- 1.2V
- 1.2V
- 1.2V
- 1.2V
- 1.2V
- Power-On Sequence: DVDD (1.2V) --> 10ms --> OVDD (1.8V) --> 10ms --> AVDD (3.3V) --> 1us --> XCLR --> 2us --> INCK
- BASIC/design/hw_DAA.sch
- hw_DAA/BASIC
- 1010xx
- jcc5
- dcs7

## Sheet 29 of 34: Sensor Multiplexion
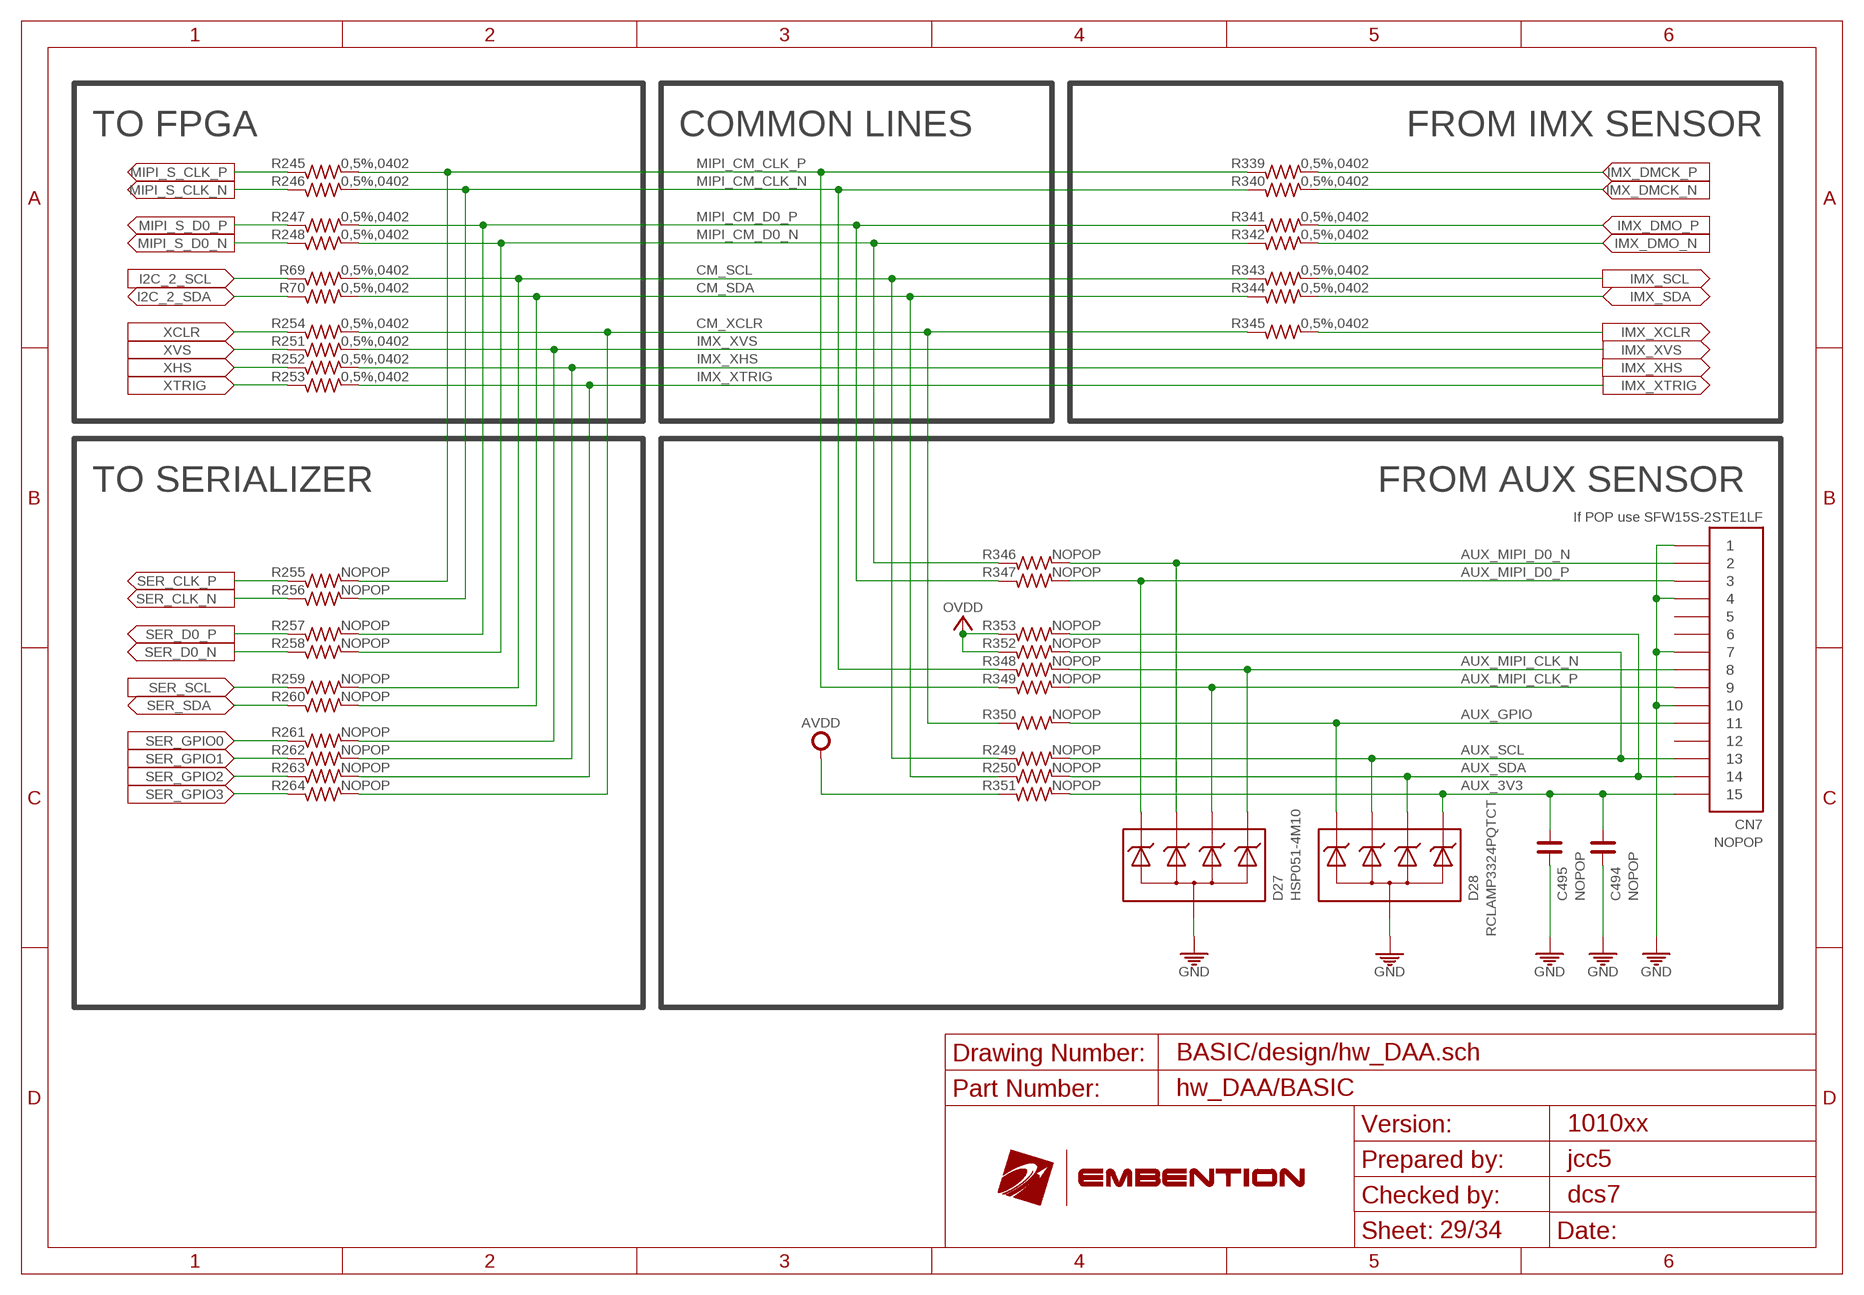
[diagram p28: schematic, sheet 29]

### Parts
C494  NOPOP  C_0402  [C0402]
C495  NOPOP  C_0402  [C0402]
CN7  NOPOP  SFW15S-2STE1LF  [SFW15S-2STE1LF]
D27  HSP051-4M10  HSP051-4M10CN  [USON-10]
D28  RCLAMP3324PQTCT  [USON-10]
R69  0,5%,0402  R_0402  [R0402]
R70  0,5%,0402  R_0402  [R0402]
R245  0,5%,0402  R_0402  [R0402]
R246  0,5%,0402  R_0402  [R0402]
R247  0,5%,0402  R_0402  [R0402]
R248  0,5%,0402  R_0402  [R0402]
R249  NOPOP  R_0402  [R0402]
R250  NOPOP  R_0402  [R0402]
R251  0,5%,0402  R_0402  [R0402]
R252  0,5%,0402  R_0402  [R0402]
R253  0,5%,0402  R_0402  [R0402]
R254  0,5%,0402  R_0402  [R0402]
R255  NOPOP  R_0402  [R0402]
R256  NOPOP  R_0402  [R0402]
R257  NOPOP  R_0402  [R0402]
R258  NOPOP  R_0402  [R0402]
R259  NOPOP  R_0402  [R0402]
R260  NOPOP  R_0402  [R0402]
R261  NOPOP  R_0402  [R0402]
R262  NOPOP  R_0402  [R0402]
R263  NOPOP  R_0402  [R0402]
R264  NOPOP  R_0402  [R0402]
R339  0,5%,0402  R_0402  [R0402]
R340  0,5%,0402  R_0402  [R0402]
R341  0,5%,0402  R_0402  [R0402]
R342  0,5%,0402  R_0402  [R0402]
R343  0,5%,0402  R_0402  [R0402]
R344  0,5%,0402  R_0402  [R0402]
R345  0,5%,0402  R_0402  [R0402]
R346  NOPOP  R_0402  [R0402]
R347  NOPOP  R_0402  [R0402]
R348  NOPOP  R_0402  [R0402]
R349  NOPOP  R_0402  [R0402]
R350  NOPOP  R_0402  [R0402]
R351  NOPOP  R_0402  [R0402]
R352  NOPOP  R_0402  [R0402]
R353  NOPOP  R_0402  [R0402]

### Nets
AUX_3V3: C494.1 C495.1 CN7.15 D28.5 D28.6 R351.1
AUX_GPIO: CN7.11 D28.1 D28.10 R350.1
AUX_MIPI_CLK_N [DIFF100]: CN7.8 D27.5 D27.6 R348.1
AUX_MIPI_CLK_P [DIFF100]: CN7.9 D27.4 D27.7 R349.1
AUX_MIPI_D0_N [DIFF100]: CN7.2 D27.2 D27.9 R346.1
AUX_MIPI_D0_P [DIFF100]: CN7.3 D27.1 D27.10 R347.1
AUX_SCL: CN7.13 D28.2 D28.9 R249.1 R352.1
AUX_SDA: CN7.14 D28.4 D28.7 R250.1 R353.1
AVDD: R351.2 ; also sheet 9,28,30
CM_SCL: R69.1 R249.2 R259.1 R343.2 ; also sheet 9
CM_SDA: R70.1 R250.2 R260.1 R344.2 ; also sheet 9
CM_XCLR: R254.1 R264.1 R345.2 R350.2
GND: C494.2 C495.2 CN7.1 CN7.4 CN7.7 CN7.10 D27.3 D27.8 D27.38 D28.3 D28.8 D28.38 ; also sheet 2,3,4,5,6,7,8,9,10,11,12,13,14,15,17,18,20,21,22,23,24,25,26,27,28,30,31,32,33
I2C_2_SCL: R69.2 ; also sheet 17
I2C_2_SDA: R70.2 ; also sheet 17
IMX_DMCK_N [DIFF100]: R340.1 ; also sheet 28
IMX_DMCK_P [DIFF100]: R339.1 ; also sheet 28
IMX_DMO_N [DIFF100]: R342.1 ; also sheet 28
IMX_DMO_P [DIFF100]: R341.1 ; also sheet 28
IMX_SCL: R343.1 ; also sheet 28,30
IMX_SDA: R344.1 ; also sheet 28,30
IMX_XCLR: R345.1 ; also sheet 28
IMX_XHS: R252.1 R262.1 ; also sheet 28
IMX_XTRIG: R253.1 R263.1 ; also sheet 28,30
IMX_XVS: R251.1 R261.1 ; also sheet 28
MIPI_CM_CLK_N [DIFF100]: R246.1 R256.1 R340.2 R348.2
MIPI_CM_CLK_P [DIFF100]: R245.1 R255.1 R339.2 R349.2
MIPI_CM_D0_N [DIFF100]: R248.1 R258.1 R342.2 R346.2
MIPI_CM_D0_P [DIFF100]: R247.1 R257.1 R341.2 R347.2
MIPI_S_CLK_N [DIFF100]: R246.2 ; also sheet 17
MIPI_S_CLK_P [DIFF100]: R245.2 ; also sheet 17
MIPI_S_D0_N [DIFF100]: R248.2 ; also sheet 17
MIPI_S_D0_P [DIFF100]: R247.2 ; also sheet 17
OVDD: R352.2 R353.2 ; also sheet 9,28,30,31,32
SER_CLK_N [DIFF100]: R256.2 ; also sheet 31
SER_CLK_P [DIFF100]: R255.2 ; also sheet 31
SER_D0_N [DIFF100]: R258.2 ; also sheet 31
SER_D0_P [DIFF100]: R257.2 ; also sheet 31
SER_GPIO0: R261.2 ; also sheet 9,31
SER_GPIO1: R262.2 ; also sheet 30,31
SER_GPIO2: R263.2 ; also sheet 31
SER_GPIO3: R264.2 ; also sheet 31
SER_SCL: R259.2 ; also sheet 31
SER_SDA: R260.2 ; also sheet 31
XCLR: R254.2 ; also sheet 17
XHS: R252.2 ; also sheet 17
XTRIG: R253.2 ; also sheet 17
XVS: R251.2 ; also sheet 17
Unconnected: CN7.5 CN7.6 CN7.12

### Notes on the sheet
- TO FPGA | COMMON LINES | FROM IMX SENSOR
- TO SERIALIZER | FROM AUX SENSOR
- If POP use SFW15S-2STE1LF
- BASIC/design/hw_DAA.sch
- hw_DAA/BASIC
- 1010xx
- jcc5
- dcs7

## Sheet 30 of 34: IMU
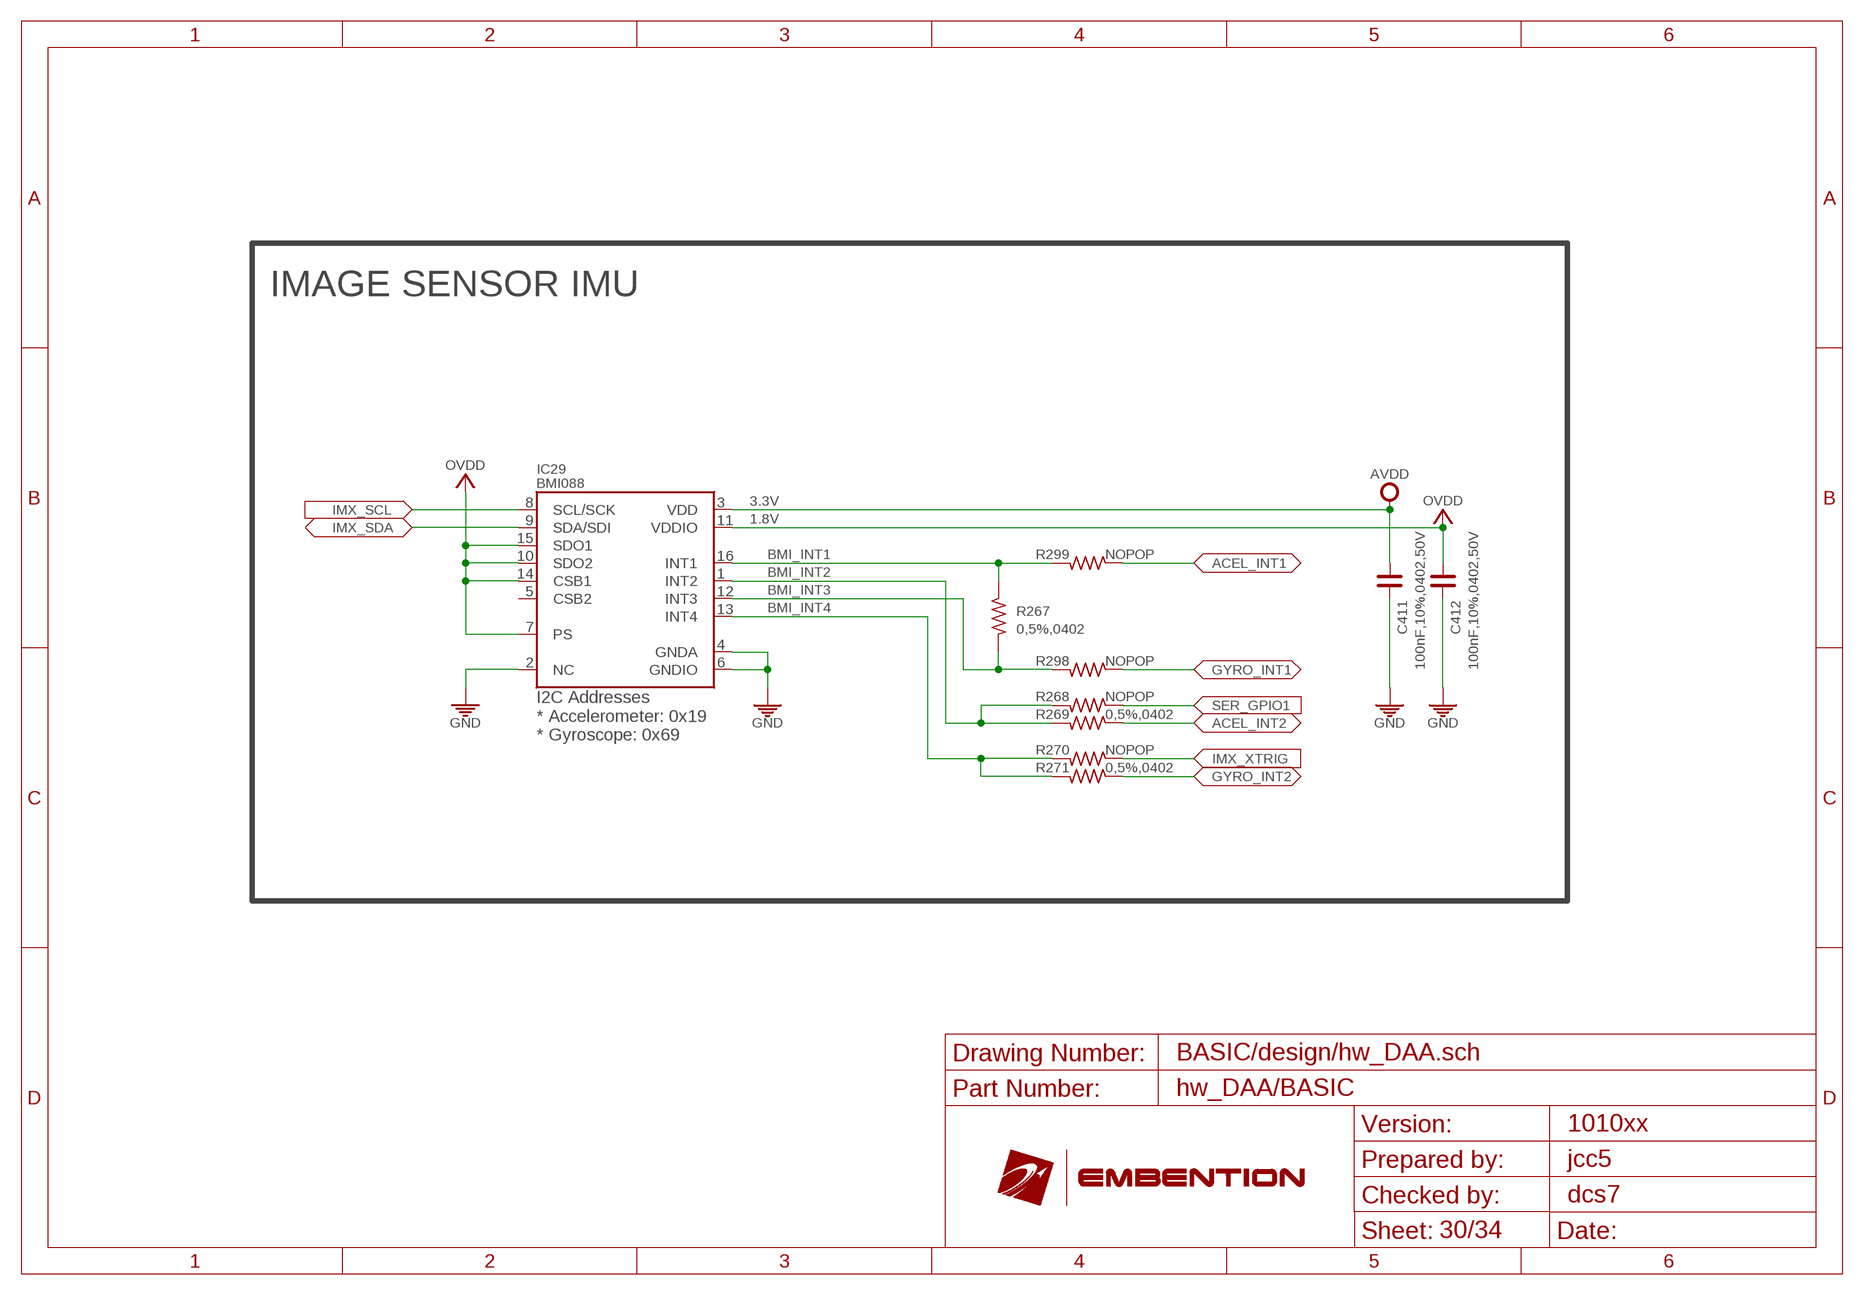
[diagram p29: schematic, sheet 30]

### Parts
C411  100nF,10%,0402,50V  C_0402  [C0402]
C412  100nF,10%,0402,50V  C_0402  [C0402]
IC29  BMI088  [BMI088]
R267  0,5%,0402  R_0402  [R0402]
R268  NOPOP  R_0402  [R0402]
R269  0,5%,0402  R_0402  [R0402]
R270  NOPOP  R_0402  [R0402]
R271  0,5%,0402  R_0402  [R0402]
R298  NOPOP  R_0402  [R0402]
R299  NOPOP  R_0402  [R0402]

### Nets
ACEL_INT1: R299.1 ; also sheet 17
ACEL_INT2: R269.1 ; also sheet 17
AVDD: C411.1 IC29.3(VDD) ; also sheet 9,28,29
BMI_INT1: IC29.16(INT1) R267.2 R299.2
BMI_INT2: IC29.1(INT2) R268.2 R269.2
BMI_INT3: IC29.12(INT3) R267.1 R298.2
BMI_INT4: IC29.13(INT4) R270.2 R271.2
GND: C411.2 C412.2 IC29.2(NC) IC29.4(GNDA) IC29.6(GNDIO) ; also sheet 2,3,4,5,6,7,8,9,10,11,12,13,14,15,17,18,20,21,22,23,24,25,26,27,28,29,31,32,33
GYRO_INT1: R298.1 ; also sheet 17
GYRO_INT2: R271.1 ; also sheet 17
IMX_SCL: IC29.8(SCL/SCK) ; also sheet 28,29
IMX_SDA: IC29.9(SDA/SDI) ; also sheet 28,29
IMX_XTRIG: R270.1 ; also sheet 28,29
OVDD: C412.1 IC29.7(PS) IC29.10(SDO2) IC29.11(VDDIO) IC29.14(CSB1) IC29.15(SDO1) ; also sheet 9,28,29,31,32
SER_GPIO1: R268.1 ; also sheet 29,31
Unconnected: IC29.5(CSB2)

### Notes on the sheet
- IMAGE SENSOR IMU
- 3.3V
- 1.8V
- I2C Addresses
  * Accelerometer: 0x19
  * Gyroscope: 0x69
- BASIC/design/hw_DAA.sch
- hw_DAA/BASIC
- 1010xx
- jcc5
- dcs7

## Sheet 31 of 34: FPD-Link III Serializer
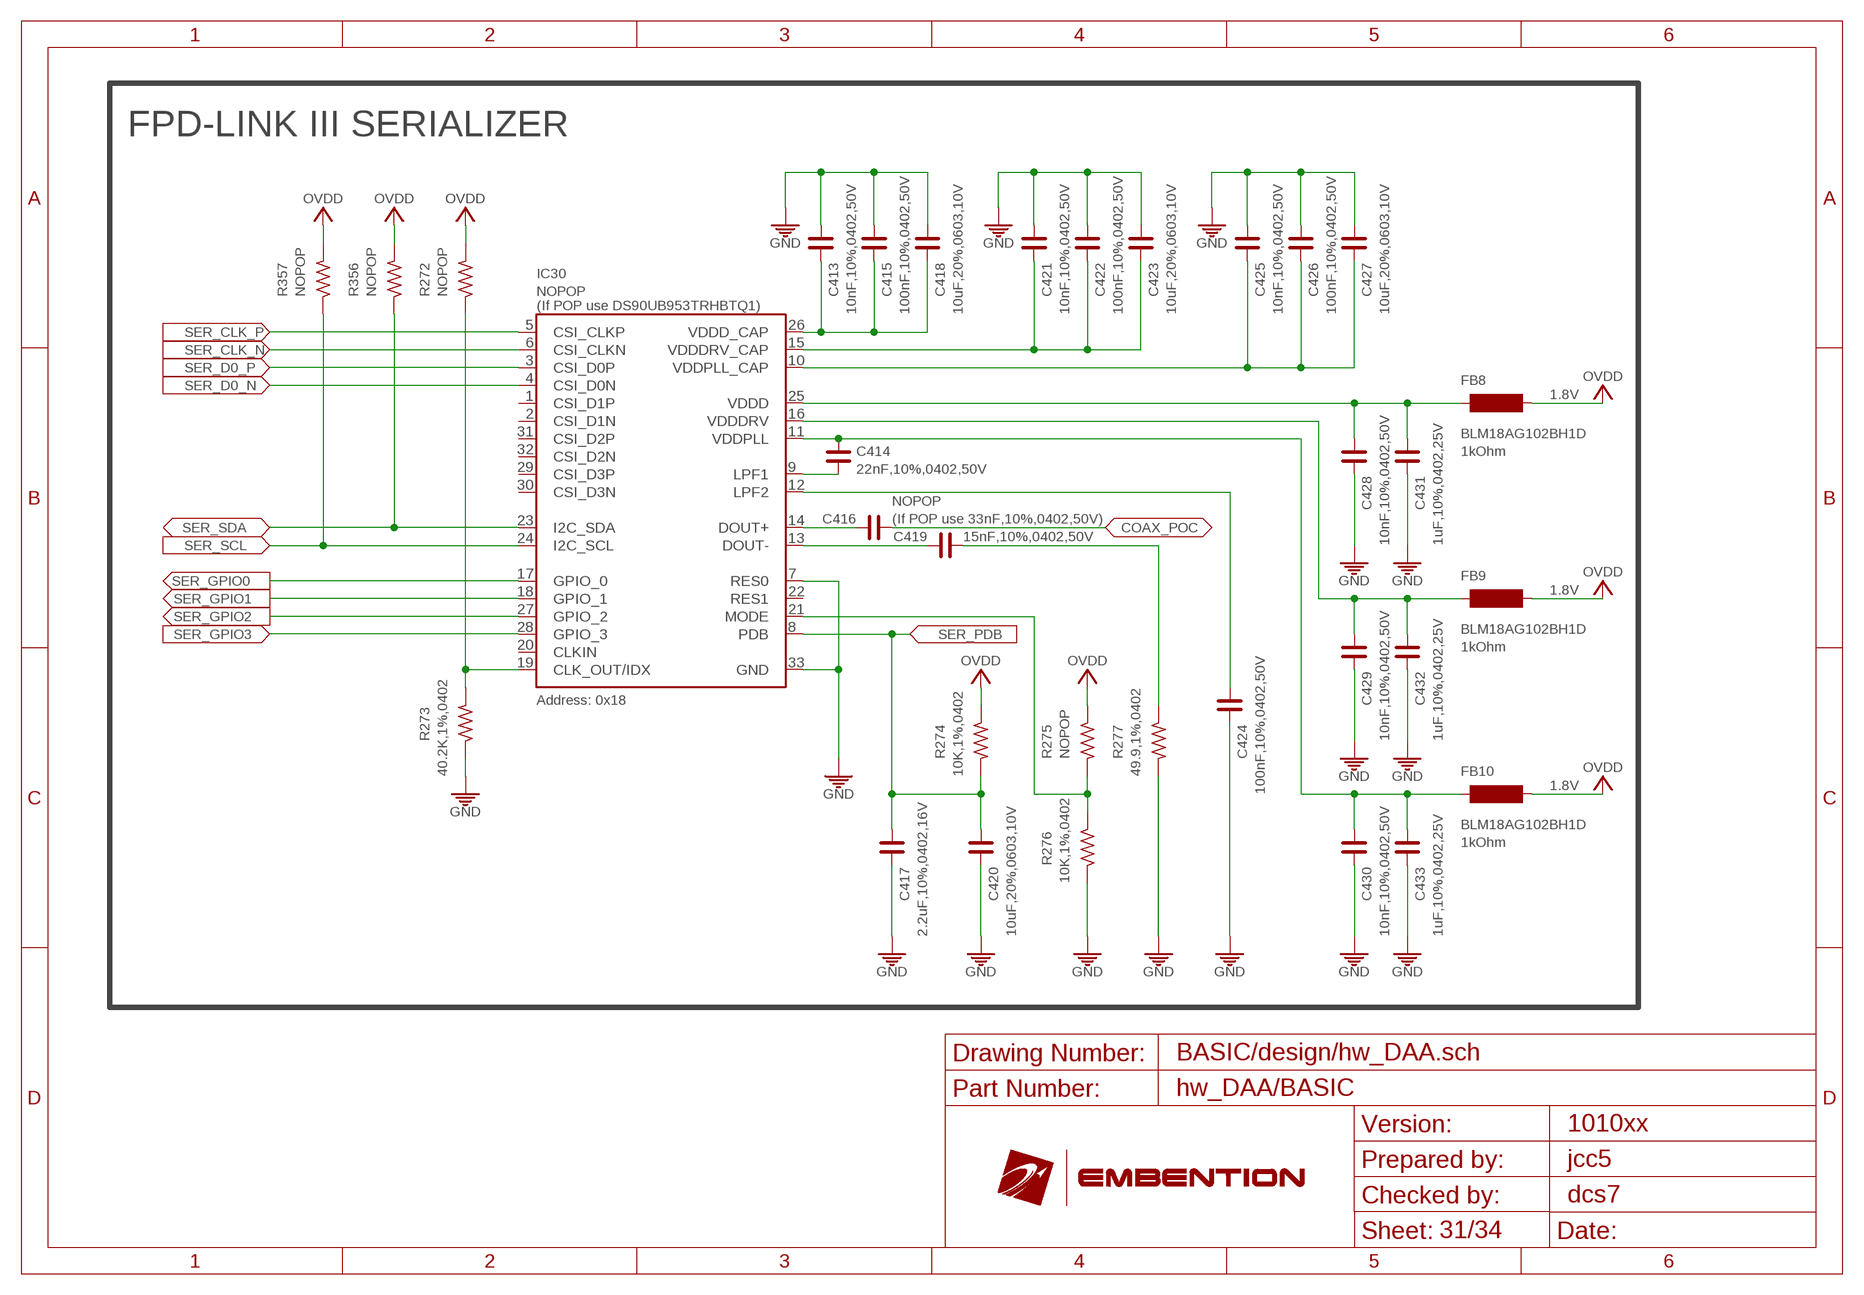
[diagram p30: schematic, sheet 31]

### Parts
C413  10nF,10%,0402,50V  C_0402  [C0402]
C414  22nF,10%,0402,50V  C_0402  [C0402]
C415  100nF,10%,0402,50V  C_0402  [C0402]
C416  NOPOP  C_0402  [C0402]
C417  2.2uF,10%,0402,16V  C_0402  [C0402]
C418  10uF,20%,0603,10V  C_0603  [C0603]
C419  15nF,10%,0402,50V  C_0402  [C0402]
C420  10uF,20%,0603,10V  C_0603  [C0603]
C421  10nF,10%,0402,50V  C_0402  [C0402]
C422  100nF,10%,0402,50V  C_0402  [C0402]
C423  10uF,20%,0603,10V  C_0603  [C0603]
C424  100nF,10%,0402,50V  C_0402  [C0402]
C425  10nF,10%,0402,50V  C_0402  [C0402]
C426  100nF,10%,0402,50V  C_0402  [C0402]
C427  10uF,20%,0603,10V  C_0603  [C0603]
C428  10nF,10%,0402,50V  C_0402  [C0402]
C429  10nF,10%,0402,50V  C_0402  [C0402]
C430  10nF,10%,0402,50V  C_0402  [C0402]
C431  1uF,10%,0402,25V  C_0402  [C0402]
C432  1uF,10%,0402,25V  C_0402  [C0402]
C433  1uF,10%,0402,25V  C_0402  [C0402]
FB8  BLM18AG102BH1D  BLM18HE152SZ1D  [L0603]
FB9  BLM18AG102BH1D  BLM18HE152SZ1D  [L0603]
FB10  BLM18AG102BH1D  BLM18HE152SZ1D  [L0603]
IC30  NOPOP  DS90UB953-Q1  [VQFN-32]
R272  NOPOP  R_0402  [R0402]
R273  40.2K,1%,0402  R_0402  [R0402]
R274  10K,1%,0402  R_0402  [R0402]
R275  NOPOP  R_0402  [R0402]
R276  10K,1%,0402  R_0402  [R0402]
R277  49.9,1%,0402  R_0402  [R0402]
R356  NOPOP  R_0402  [R0402]
R357  NOPOP  R_0402  [R0402]

### Nets
COAX_POC [COAX_50]: C416.2 ; also sheet 2,32
COAX_SER [COAX_50]: C416.1 IC30.14(DOUT+)
GND: C413.1 C415.1 C417.2 C418.1 C420.2 C421.1 C422.1 C423.1 C424.1 C425.1 C426.1 C427.1 C428.2 C429.2 C430.2 C431.2 C432.2 C433.2 IC30.7(RES0) IC30.33(GND) R273.1 R276.1 R277.1 ; also sheet 2,3,4,5,6,7,8,9,10,11,12,13,14,15,17,18,20,21,22,23,24,25,26,27,28,29,30,32,33
LPF1: C414.1 IC30.9(LPF1)
LPF2: C424.2 IC30.12(LPF2)
N$106: C419.2 IC30.13(DOUT-)
N$107: C419.1 R277.2
OVDD: FB8.2 FB9.2 FB10.2 R272.2 R274.2 R275.2 R356.2 R357.2 ; also sheet 9,28,29,30,32
SER_CLK_N [DIFF100]: IC30.6(CSI_CLKN) ; also sheet 29
SER_CLK_P [DIFF100]: IC30.5(CSI_CLKP) ; also sheet 29
SER_D0_N [DIFF100]: IC30.4(CSI_D0N) ; also sheet 29
SER_D0_P [DIFF100]: IC30.3(CSI_D0P) ; also sheet 29
SER_GPIO0: IC30.17(GPIO_0) ; also sheet 9,29
SER_GPIO1: IC30.18(GPIO_1) ; also sheet 29,30
SER_GPIO2: IC30.27(GPIO_2) ; also sheet 29
SER_GPIO3: IC30.28(GPIO_3) ; also sheet 29
SER_IDX: IC30.19(CLK_OUT/IDX) R272.1 R273.2
SER_MODE: IC30.21(MODE) R275.1 R276.2
SER_PDB: C417.1 C420.1 IC30.8(PDB) R274.1 ; also sheet 9
SER_SCL: IC30.24(I2C_SCL) R357.1 ; also sheet 29
SER_SDA: IC30.23(I2C_SDA) R356.1 ; also sheet 29
SER_VDD_CAP: C413.2 C415.2 C418.2 IC30.26(VDDD_CAP)
SER_VDDD: C428.1 C431.1 FB8.1 IC30.25(VDDD)
SER_VDDDRV: C429.1 C432.1 FB9.1 IC30.16(VDDDRV)
SER_VDDDRV_CAP: C421.2 C422.2 C423.2 IC30.15(VDDDRV_CAP)
SER_VDDPLL: C414.2 C430.1 C433.1 FB10.1 IC30.11(VDDPLL)
SER_VDDPLL_CAP: C425.2 C426.2 C427.2 IC30.10(VDDPLL_CAP)
Unconnected: IC30.1(CSI_D1P) IC30.2(CSI_D1N) IC30.20(CLKIN) IC30.22(RES1) IC30.29(CSI_D3P) IC30.30(CSI_D3N) IC30.31(CSI_D2P) IC30.32(CSI_D2N)

### Notes on the sheet
- FPD-LINK III SERIALIZER
- (If POP use DS90UB953TRHBTQ1)
- 1.8V
- 1kOhm
- (If POP use 33nF,10%,0402,50V)
- 1.8V
- 1kOhm
- Address: 0x18
- 1.8V
- 1kOhm
- BASIC/design/hw_DAA.sch
- hw_DAA/BASIC
- 1010xx
- jcc5
- dcs7